# Altium project Flight Controller.PrjPcb (part 1 of 2)
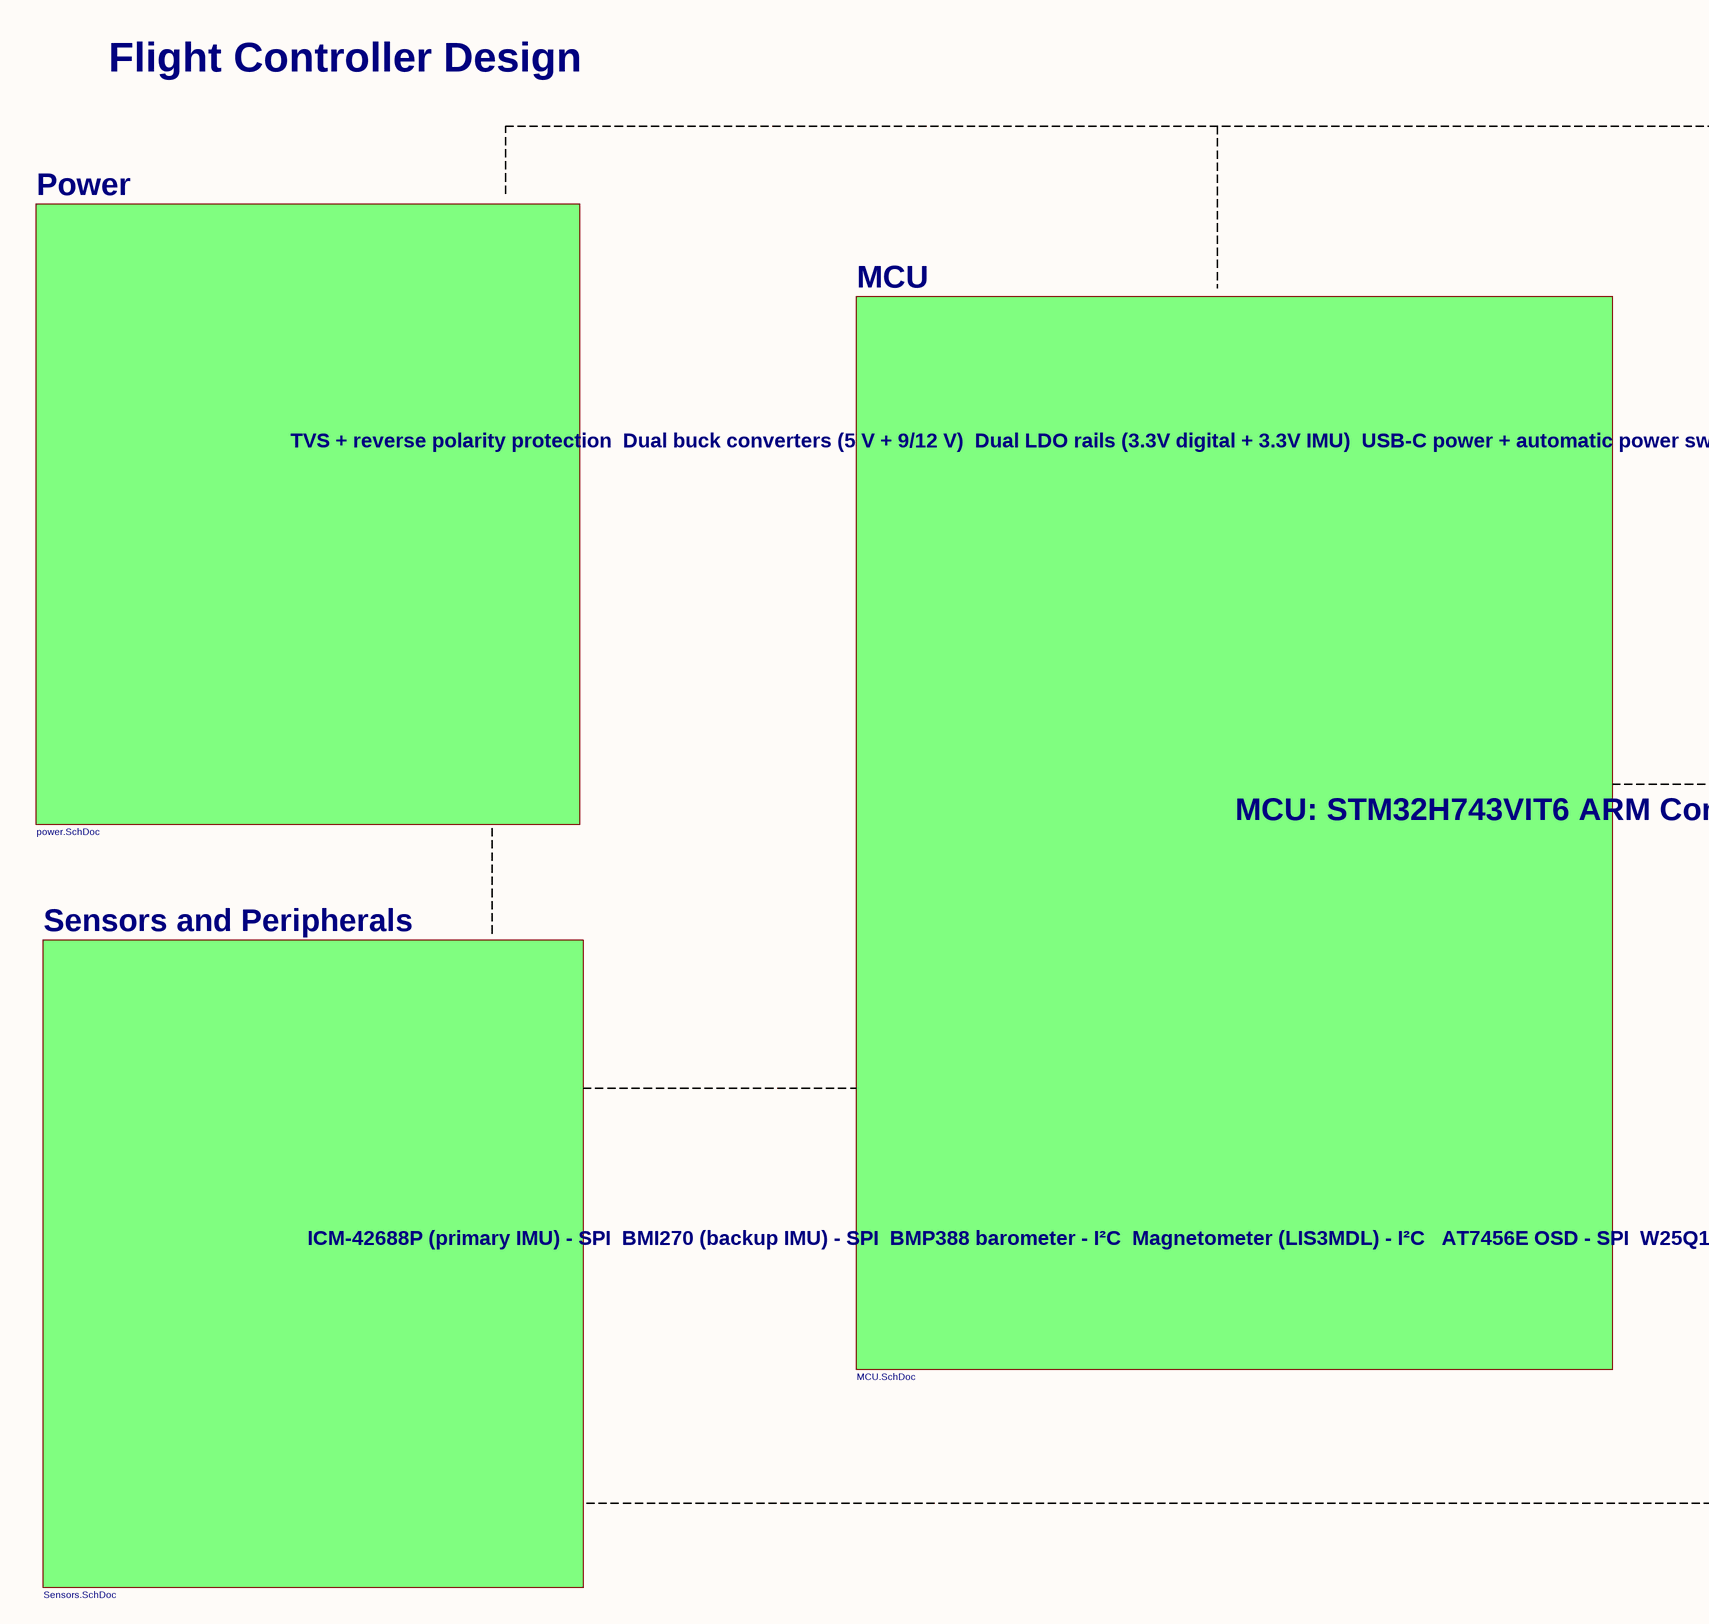
[diagram p0: Flight Controller.SchDoc, left]
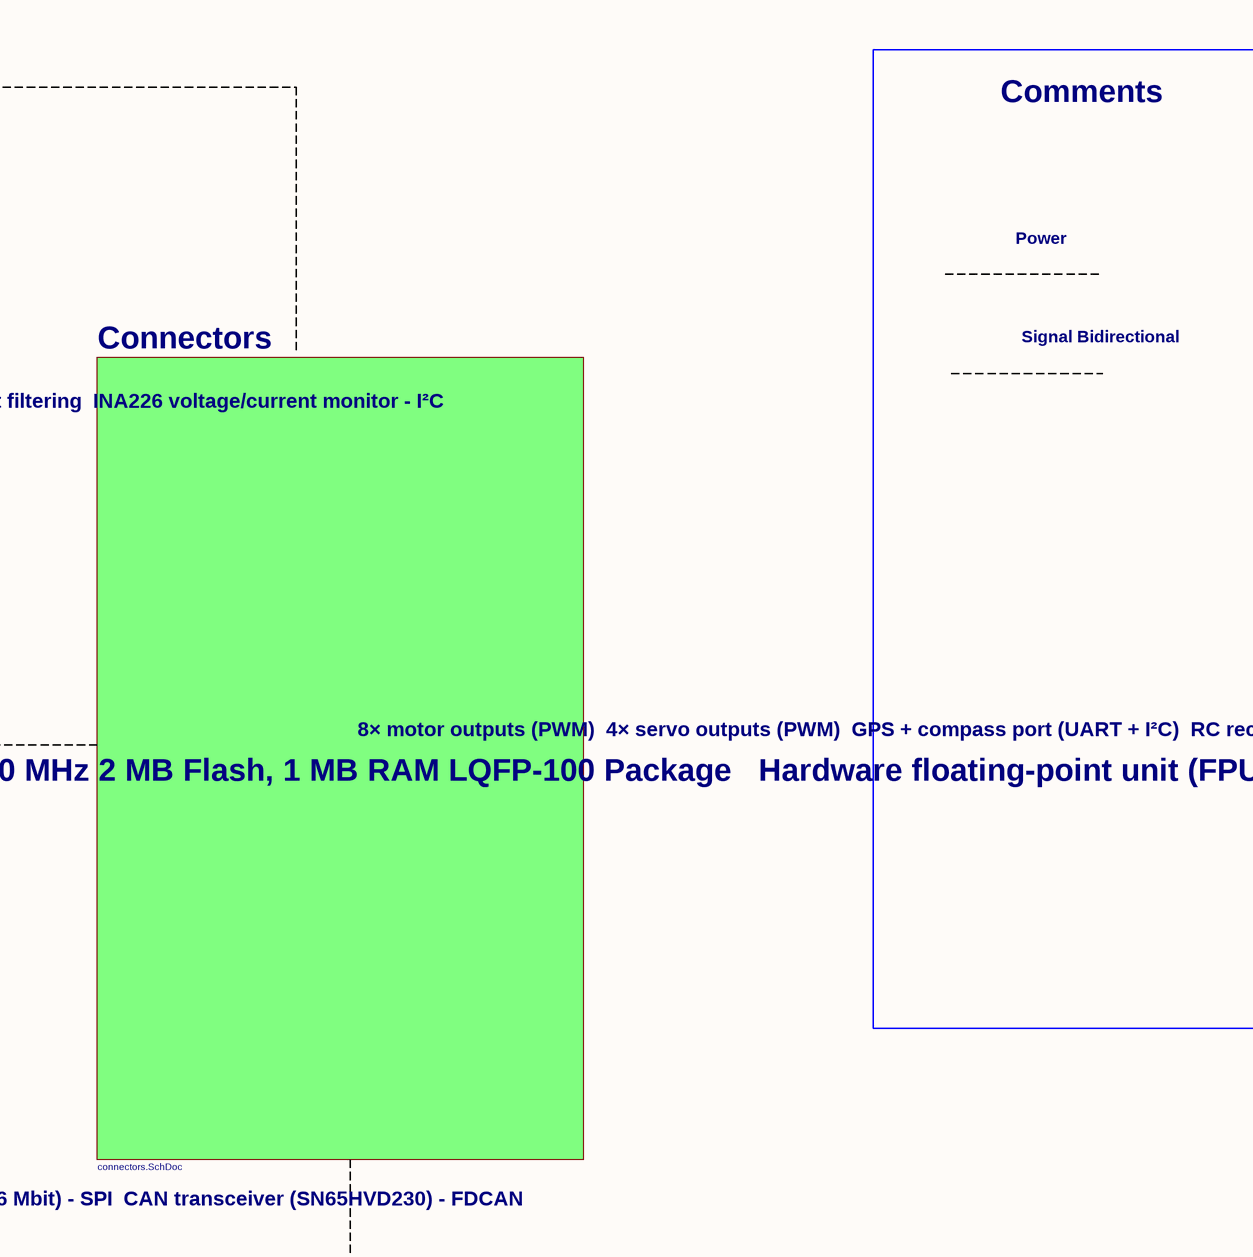
[diagram p1: Flight Controller.SchDoc, right]
5 sheets, 185 parts. Net scope: flat (ports and power ports of the same name join across sheets).
Board file: Flight Controller.PcbDoc
Sheets:
  Flight Controller.SchDoc
    Power = power.SchDoc
    MCU = MCU.SchDoc
    Connectors = connectors.SchDoc
    Sensors and Peripherals = Sensors.SchDoc

## Sheet Flight Controller.SchDoc
size 711 x 342 mm

### Sub-sheets
Connectors = connectors.SchDoc: no entries
MCU = MCU.SchDoc: no entries
Power = power.SchDoc: no entries
Sensors and Peripherals = Sensors.SchDoc: no entries

### Notes on the sheet
- Flight Controller Design
- Comments
- Power
- Signal Bidirectional
- TVS + reverse polarity protection
  Dual buck converters (5 V + 9/12 V)
  Dual LDO rails (3.3V digital + 3.3V IMU)
  USB-C power + automatic power switching
  Basic input filtering
  INA226 voltage/current monitor - I²C
- 8× motor outputs (PWM)
  4× servo outputs (PWM)
  GPS + compass port (UART + I²C)
  RC receiver (SBUS / ELRS UART)
  Telemetry UART
  CAN bus (4-pin)
  Airspeed (I²C)
  VTX (analog + 9/12 V)
  DJI FPV (UART + SBUS)
  USB-C port
- MCU: STM32H743VIT6
  ARM Cortex-M7 @ 480 MHz
  2 MB Flash, 1 MB RAM
  LQFP-100 Package
  Hardware floating-point unit (FPU)
  16-bit/32-bit timers with PWM
  4× SPI, 4× I2C, 8× USART/UART
  2× FDCAN, USB OTG FS/HS
  3× 16-bit ADC (up to 36 channels)
  DMA with DMAMUX
  Built-in UART signal inversion
  Operating voltage: 1.71V - 3.6V
- ICM-42688P (primary IMU) - SPI
  BMI270 (backup IMU) - SPI
  BMP388 barometer - I²C
  Magnetometer (LIS3MDL) - I²C
  AT7456E OSD - SPI
  W25Q128 flash memory (16 Mbit) - SPI
  CAN transceiver (SN65HVD230) - FDCAN
- 1
- 2
- 3
- 4
- 5
- 6
- 7
- 8
- 9
- 10
- 11
- 12
- 13
- 14
- A
- B
- C
- D
- E
- F
- Title:
- File: Flight Controller.kicad_sch
- Sheet: /
- KiCad E.D.A.  kicad (5.1.4)-1
- Size: User
- Date:
- Rev:
- Id: 1/1

## Sheet power.SchDoc
size 584 x 279 mm
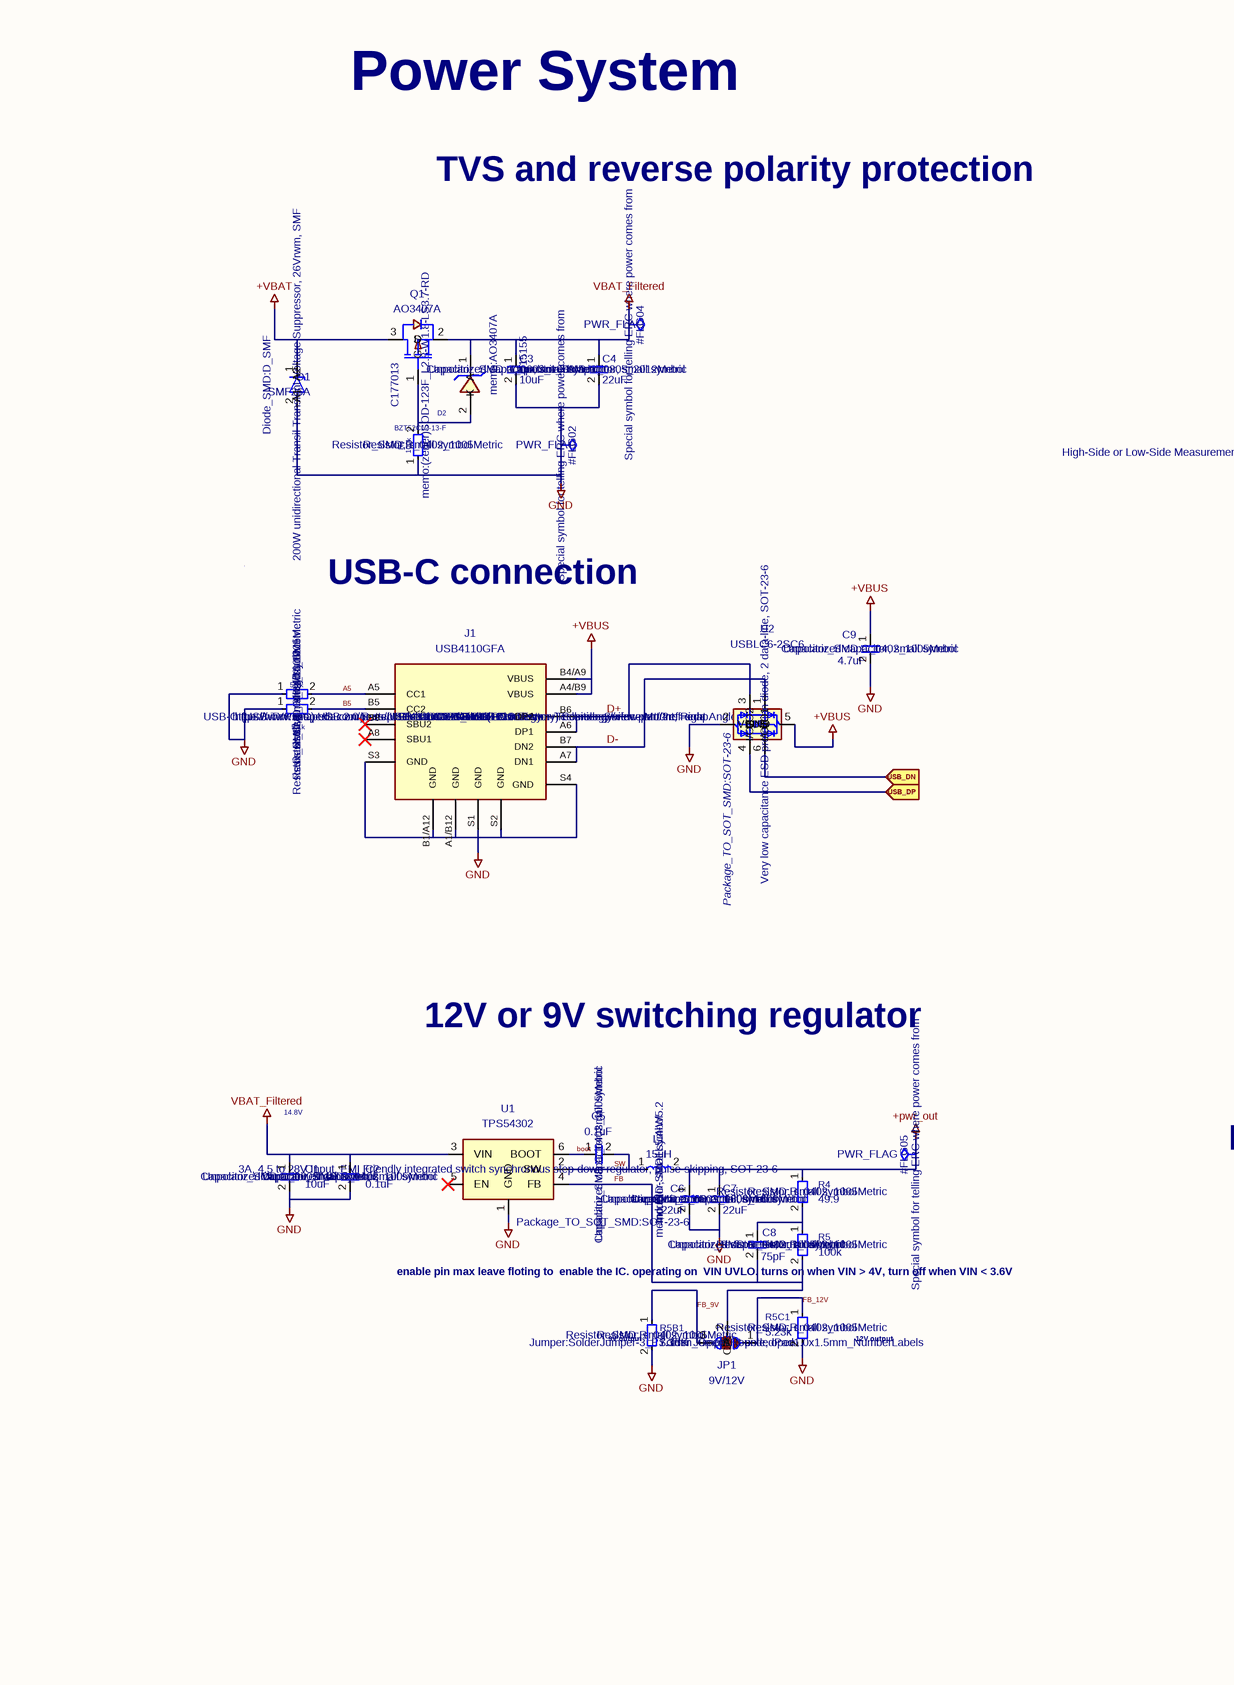
[diagram p2: power.SchDoc, left]
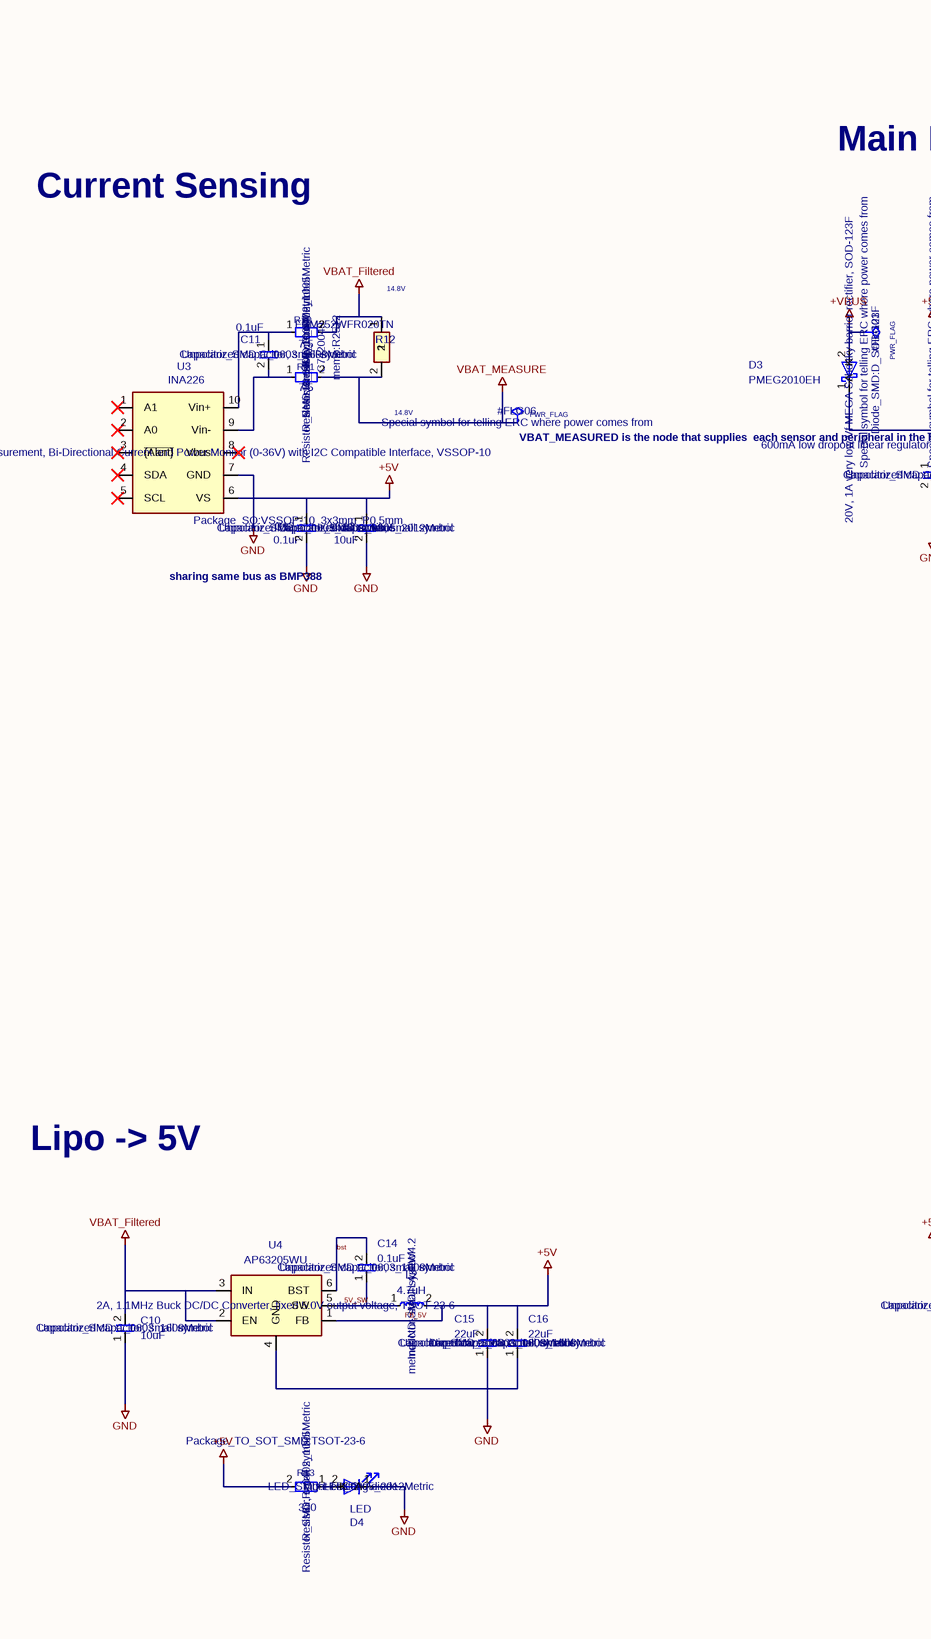
[diagram p3: power.SchDoc, middle]
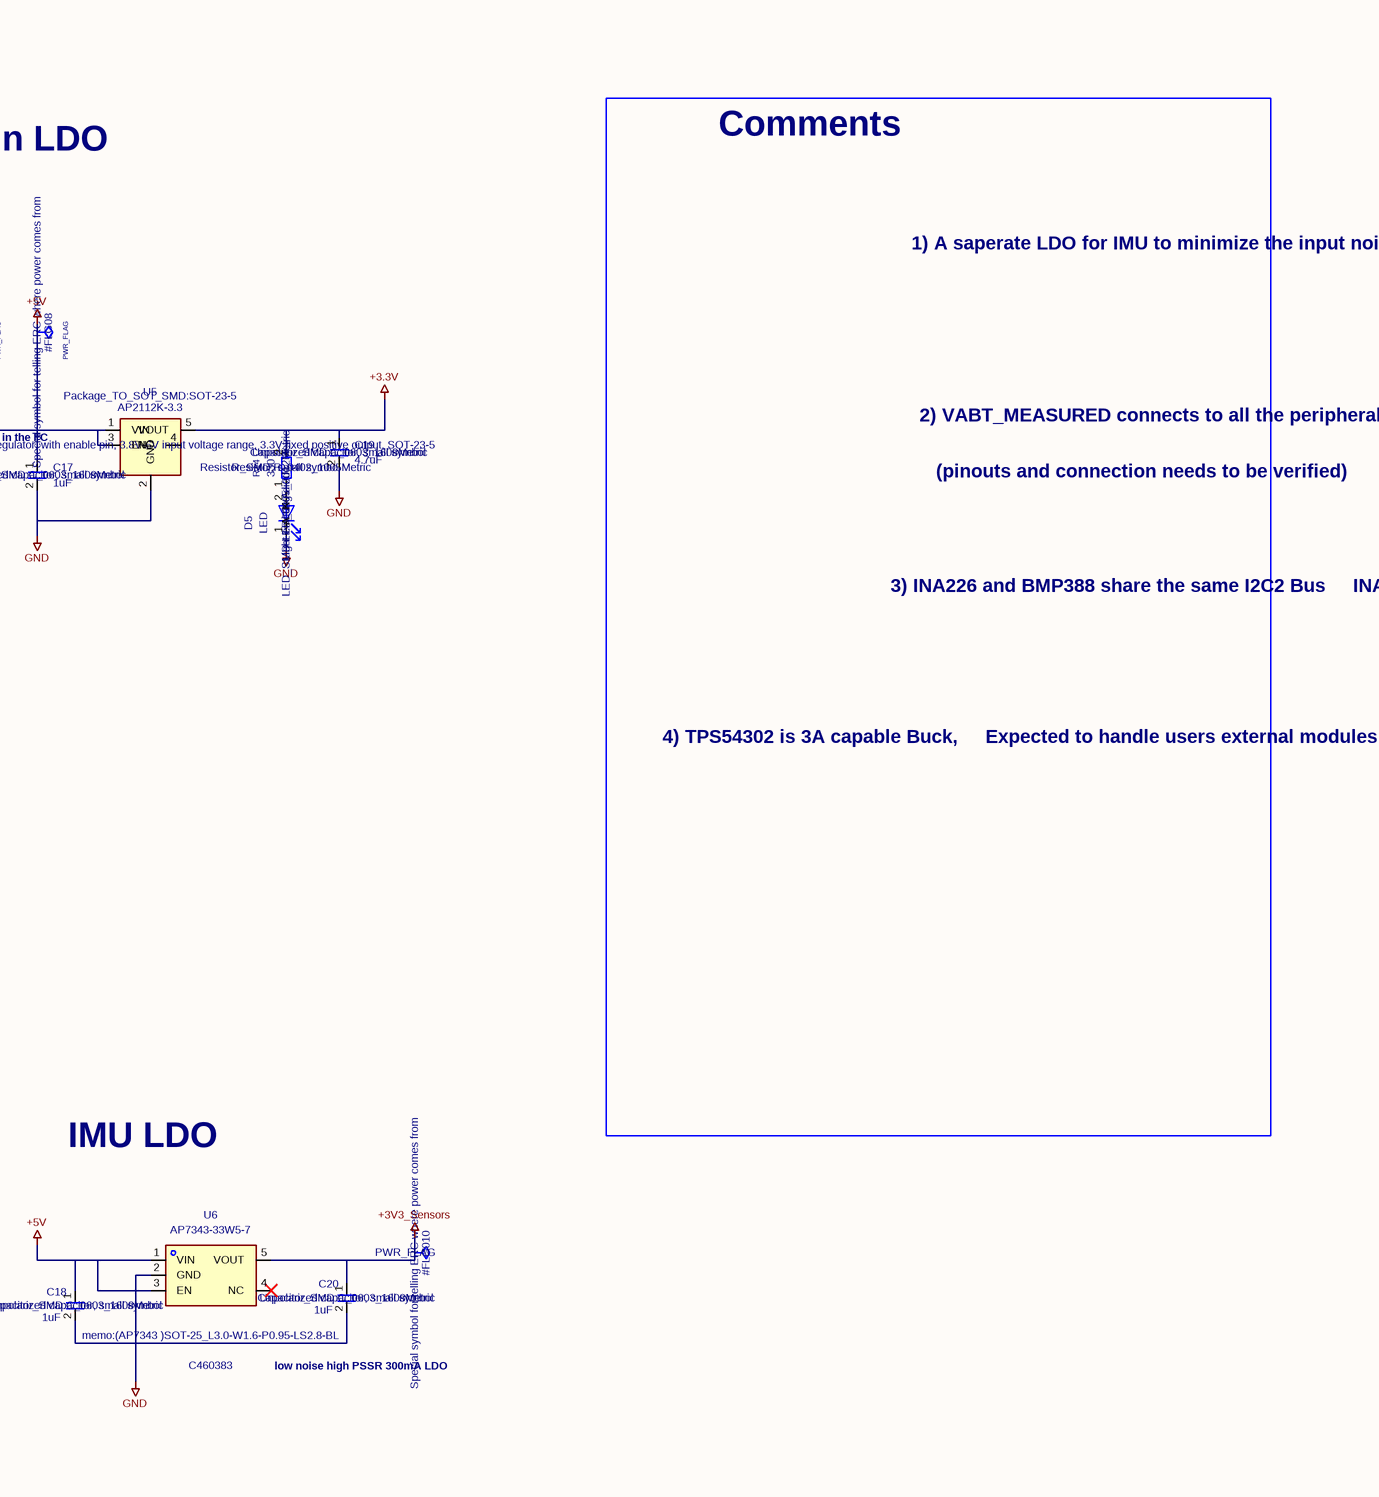
[diagram p4: power.SchDoc, right]

### Parts
#FLG01  Description: Special symbol for telling ERC where power comes from  (hidden comment: PWR_FLAG)  (graphical)
#FLG02  Description: Special symbol for telling ERC where power comes from  (hidden comment: PWR_FLAG)  (graphical)
#FLG04  Description: Special symbol for telling ERC where power comes from  (hidden comment: PWR_FLAG)  (graphical)
#FLG05  Description: Special symbol for telling ERC where power comes from  (hidden comment: PWR_FLAG)  (graphical)
#FLG06  Description: Special symbol for telling ERC where power comes from  (hidden comment: PWR_FLAG)  (graphical)
#FLG08  Description: Special symbol for telling ERC where power comes from  (hidden comment: PWR_FLAG)  (graphical)
#FLG010  Description: Special symbol for telling ERC where power comes from  (hidden comment: PWR_FLAG)  (graphical)
C1  Description: Unpolarized capacitor, small symbol  Footprint: Capacitor_SMD:C_0603_1608Metric  [C_0603_1608Metric]  (hidden comment: 10uF)
C2  Description: Unpolarized capacitor, small symbol  Footprint: Capacitor_SMD:C_0402_1005Metric  [C_0402_1005Metric]  (hidden comment: 0.1uF)
C3  Description: Unpolarized capacitor, small symbol  Footprint: Capacitor_SMD:C_0603_1608Metric  [C_0603_1608Metric]  (hidden comment: 10uF)
C4  Description: Unpolarized capacitor, small symbol  Footprint: Capacitor_SMD:C_0805_2012Metric  [C_0805_2012Metric]  (hidden comment: 22uF)
C5  Description: Unpolarized capacitor, small symbol  Footprint: Capacitor_SMD:C_0402_1005Metric  [C_0402_1005Metric]  (hidden comment: 0.1uF)
C6  Description: Unpolarized capacitor, small symbol  Footprint: Capacitor_SMD:C_0603_1608Metric  [C_0603_1608Metric]  (hidden comment: 22uF)
C7  Description: Unpolarized capacitor, small symbol  Footprint: Capacitor_SMD:C_0603_1608Metric  [C_0603_1608Metric]  (hidden comment: 22uF)
C8  Description: Unpolarized capacitor, small symbol  Footprint: Capacitor_SMD:C_0402_1005Metric  [C_0402_1005Metric]  (hidden comment: 75pF)
C9  Description: Unpolarized capacitor, small symbol  Footprint: Capacitor_SMD:C_0402_1005Metric  [C_0402_1005Metric]  (hidden comment: 4.7uF)
C10  Description: Unpolarized capacitor, small symbol  Footprint: Capacitor_SMD:C_0603_1608Metric  [C_0603_1608Metric]  (hidden comment: 10uF)
C11  Description: Unpolarized capacitor, small symbol  Footprint: Capacitor_SMD:C_0603_1608Metric  [C_0603_1608Metric]  (hidden comment: 0.1uF)
C12  Description: Unpolarized capacitor, small symbol  Footprint: Capacitor_SMD:C_0603_1608Metric  [C_0603_1608Metric]  (hidden comment: 0.1uF)
C13  Description: Unpolarized capacitor, small symbol  Footprint: Capacitor_SMD:C_0805_2012Metric  [C_0805_2012Metric]  (hidden comment: 10uF)
C14  Description: Unpolarized capacitor, small symbol  Footprint: Capacitor_SMD:C_0603_1608Metric  [C_0603_1608Metric]  (hidden comment: 0.1uF)
C15  Description: Unpolarized capacitor, small symbol  Footprint: Capacitor_SMD:C_0603_1608Metric  [C_0603_1608Metric]  (hidden comment: 22uF)
C16  Description: Unpolarized capacitor, small symbol  Footprint: Capacitor_SMD:C_0603_1608Metric  [C_0603_1608Metric]  (hidden comment: 22uF)
C17  Description: Unpolarized capacitor, small symbol  Footprint: Capacitor_SMD:C_0603_1608Metric  [C_0603_1608Metric]  (hidden comment: 1uF)
C18  Description: Unpolarized capacitor, small symbol  Footprint: Capacitor_SMD:C_0603_1608Metric  [C_0603_1608Metric]  (hidden comment: 1uF)
C19  Description: Unpolarized capacitor, small symbol  Footprint: Capacitor_SMD:C_0603_1608Metric  [C_0603_1608Metric]  (hidden comment: 4.7uF)
C20  Description: Unpolarized capacitor, small symbol  Footprint: Capacitor_SMD:C_0603_1608Metric  [C_0603_1608Metric]  (hidden comment: 1uF)
D1  Description: 200W unidirectional Transil Transient Voltage Suppressor, 26Vrwm, SMF  Footprint: Diode_SMD:D_SMF  [D_SMF]  (hidden comment: SMF26A)
D2  LCSC Part: C177013  Footprint: memo:(zener)SOD-123F_L2.8-W1.8-LS3.7-RD  [(zener)SOD-123F_L2.8-W1.8-LS3.7-RD]  (hidden comment: BZT52C12-13-F)
D3  Description: 20V, 1A very low Vf MEGA Schottky barrier rectifier, SOD-123F  Footprint: Diode_SMD:D_SOD-123F  [D_SOD-123F]  (hidden comment: PMEG2010EH)
D4  Description: Light emitting diode  Sim.Pins: 1=K 2=A  Footprint: LED_SMD:LED_0805_2012Metric  [LED_0805_2012Metric]  (hidden comment: LED)
D5  Description: Light emitting diode  Sim.Pins: 1=K 2=A  Footprint: LED_SMD:LED_0805_2012Metric  [LED_0805_2012Metric]  (hidden comment: LED)
J1  MF: Global Connector Technology  Description_1: USB-C (USB TYPE-C) USB 2.0 Receptacle Connector 24 (16+8 Dummy) Position Surface Mount, Right Angle  Package: None  Availability: In Stock  Footprint: memo:GCT_USB4110GFA  [GCT_USB4110GFA]  (hidden comment: USB4110GFA)
JP1  Description: Solder Jumper, 3-pole, open  Footprint: Jumper:SolderJumper-3_P1.3mm_Open_RoundedPad1.0x1.5mm_NumberLabels  [SolderJumper-3_P1.3mm_Open_RoundedPad1.0x1.5mm_NumberLabels]  (hidden comment: 9V/12V)
L1  Description: Inductor, small symbol  Footprint: memo:IND-SMD_L5.4-W5.2  [IND-SMD_L5.4-W5.2]  (hidden comment: 15uH)
L2  Description: Inductor, small symbol  Footprint: memo:IND-SMD_L4.4-W4.2  [IND-SMD_L4.4-W4.2]  (hidden comment: 4.7uH)
Q1  LCSC Part: C15155  Footprint: memo:AO3407A  [AO3407A]  (hidden comment: AO3407A)
R1  Description: Resistor, small symbol  Footprint: Resistor_SMD:R_0402_1005Metric  [R_0402_1005Metric]  (hidden comment: 5.1k)
R2  Description: Resistor, small symbol  Footprint: Resistor_SMD:R_0402_1005Metric  [R_0402_1005Metric]  (hidden comment: 5.1k)
R3  Description: Resistor, small symbol  Footprint: Resistor_SMD:R_0402_1005Metric  [R_0402_1005Metric]  (hidden comment: 100k)
R4  Description: Resistor, small symbol  Footprint: Resistor_SMD:R_0402_1005Metric  [R_0402_1005Metric]  (hidden comment: 49.9)
R5  Description: Resistor, small symbol  Footprint: Resistor_SMD:R_0402_1005Metric  [R_0402_1005Metric]  (hidden comment: 100k)
R5B1  Description: Resistor, small symbol  Footprint: Resistor_SMD:R_0402_1005Metric  [R_0402_1005Metric]  (hidden comment: 7.15K)
R5C1  Description: Resistor, small symbol  Footprint: Resistor_SMD:R_0402_1005Metric  [R_0402_1005Metric]  (hidden comment: 5.23k)
R10  Description: Resistor, small symbol  Footprint: Resistor_SMD:R_0402_1005Metric  [R_0402_1005Metric]  (hidden comment: 7.5)
R11  Description: Resistor, small symbol  Footprint: Resistor_SMD:R_0402_1005Metric  [R_0402_1005Metric]  (hidden comment: 7.5)
R12  LCSC Part: C7420049  Footprint: memo:R2512  [R2512]  (hidden comment: FRM252WFR020TN)
R13  Description: Resistor, small symbol  Footprint: Resistor_SMD:R_0402_1005Metric  [R_0402_1005Metric]  (hidden comment: 330)
R14  Description: Resistor, small symbol  Footprint: Resistor_SMD:R_0402_1005Metric  [R_0402_1005Metric]  (hidden comment: 330)
U1  Description: 3A, 4.5 to 28V Input, EMI Friendly integrated switch synchronous step-down regulator, pulse-skipping, SOT-23-6  Footprint: Package_TO_SOT_SMD:SOT-23-6  [SOT-23-6]  (hidden comment: TPS54302)
U2  Description: Very low capacitance ESD protection diode, 2 data-line, SOT-23-6  Footprint: Package_TO_SOT_SMD:SOT-23-6  [SOT-23-6]  (hidden comment: USBLC6-2SC6)
U3  Description: High-Side or Low-Side Measurement, Bi-Directional Current and Power Monitor (0-36V) with I2C Compatible Interface, VSSOP-10  Footprint: Package_SO:VSSOP-10_3x3mm_P0.5mm  [VSSOP-10_3x3mm_P0.5mm]  (hidden comment: INA226)
U4  Description: 2A, 1.1MHz Buck DC/DC Converter, fixed 5.0V output voltage, TSOT-23-6  Footprint: Package_TO_SOT_SMD:TSOT-23-6  [TSOT-23-6]  (hidden comment: AP63205WU)
U5  Description: 600mA low dropout linear regulator, with enable pin, 3.8V-6V input voltage range, 3.3V fixed positive output, SOT-23-5  Footprint: Package_TO_SOT_SMD:SOT-23-5  [SOT-23-5]  (hidden comment: AP2112K-3.3)
U6  LCSC Part: C460383  Footprint: memo:(AP7343 )SOT-25_L3.0-W1.6-P0.95-LS2.8-BL  [(AP7343 )SOT-25_L3.0-W1.6-P0.95-LS2.8-BL]  (hidden comment: AP7343-33W5-7)

### Ports
USB_DN (in), USB_DP (in)

### Nets
+3.3V: C19.1 R14.2 U5.5(VOUT)
+3V3_Sensors: #FLG010.1 C20.1 U6.5(VOUT)
+pwr_out: #FLG05.1 C6.1 C7.1 L1.2 R4.1
+VBAT: D1.1(A1) Q1.3(D)
+VBUS: #FLG01.1 C9.1 D3.2(A) J1.A4/B9(VBUS) J1.B4/A9(VBUS) U2.5(VBUS)
FB_5V: #FLG08.1 C12.1 C13.1 C15.2 C16.2 C17.1 C18.1 D3.1(K) L2.2 R13.2 U3.6(VS) U4.1(FB) U5.1(VIN) U5.3(EN) U6.1(VIN) U6.3(EN)  [also labelled +5V]
GND: #FLG02.1 C1.2 C2.2 C3.2 C4.2 C6.2 C7.2 C9.2 C10.1 C12.2 C13.2 C15.1 C16.1 C17.2 C18.2 C19.2 C20.2 D1.2(A2) D4.1(K) D5.1(K) J1.A1/B12(GND) J1.B1/A12(GND) J1.S1(GND) J1.S2(GND) J1.S3(GND) J1.S4(GND) R1.1 R2.1 R3.1 R5B1.2 R5C1.2 U1.1(GND) U2.2(GND) U3.7(GND) U4.4(GND) U5.2(GND) U6.2(GND)
VBAT_Filtered: #FLG04.1 C1.1 C2.1 C3.1 C4.1 C10.2 D2.1(K) Q1.2(S) R10.2 R12.1 U1.3(VIN) U4.2(EN) U4.3(IN)
VBAT_MEASURE: #FLG06.1 R11.2 R12.2
5V_SW: C14.1 L2.1 U4.5(SW)
A5: J1.A5(CC1) R1.2
B5: J1.B5(CC2) R2.2
boot: C5.1 U1.6(BOOT)
bst: C14.2 U4.6(BST)
D+: J1.A6(DP1) J1.B6(DP2) U2.3(I/O2)
D-: J1.A7(DN1) J1.B7(DN2) U2.1(I/O1)
FB: C8.2 JP1.2(C) R5.2 U1.4(FB)
FB_9V: JP1.3(B) R5B1.1
FB_12V: JP1.1(A) R5C1.1
SW: C5.2 L1.1 U1.2(SW)
USB_DN: U2.6(I/O1) ; port USB_DN
USB_DP: U2.4(I/O2) ; port USB_DP
NetC8_1: C8.1 R4.2 R5.1
NetC11_1: C11.1 R10.1 U3.10(Vin+)
NetC11_2: C11.2 R11.1 U3.9(Vin-)
NetD2_2: D2.2(A) Q1.1(G) R3.2
NetD4_2: D4.2(A) R13.1
NetD5_2: D5.2(A) R14.1

Not connected (* = marked no-connect by the designer): J1 A8(SBU1)* B8(SBU2)*; U1 5(EN)*; U3 1(A1)* 2(A0)* 3(~{{Alert}})* 4(SDA)* 5(SCL)* 8(Vbus)*; U5 4(NC); U6 4(NC)*

### Notes on the sheet
- Power System
- Main LDO
- Comments
- TVS and reverse polarity protection
- Current Sensing
- (near R12) 14.8V
- 1) A saperate LDO for IMU to minimize the input noise
  per multiple firmwares advise.
- (near #FLG06) VBAT_MEASURED is the node that supplies
  each sensor and peripheral in the FC
- 2) VABT_MEASURED connects to all the peripherals on the
  FC and is able to measure Current and Voltage over I2C
  eliminating the need for ADC pins on mcu.
- (pinouts and connection needs to be verified)
- USB-C connection
- (near C12) sharing same bus as BMP388
- 3) INA226 and BMP388 share the same I2C2 Bus
  INA226 Address : 0X40 A0, A1 -> GND
  BMP388 Address : 0X76  SDO -> GND
- 4) TPS54302 is 3A capable Buck,
  Expected to handle users external modules
  attachements. DJI Air Unit, Analog VTX, etc...
- 12V or 9V switching regulator
- 14.8V
- Lipo -> 5V
- IMU LDO
- enable pin max leave floting to
  enable the IC. operating on
  VIN UVLO. turns on when VIN
  > 4V, turn off when VIN < 3.6V
- (near R5B1) 9V output
- (near R5C1) 12V output
- low noise high PSSR 300mA LDO
- 1
- 2
- 3
- 4
- 5
- 6
- 7
- 8
- 9
- 10
- 11
- A
- B
- C
- D
- E
- Title:
- File: power.kicad_sch
- Sheet: /
- KiCad E.D.A.  kicad (5.1.4)-1
- Size: User
- Date:
- Rev:
- Id: 1/1

### Library data of the parts
C1-C20 = C_Small
  C1 C3 C10 C13: Value: 10uF
  C2 C5 C11 C12 C14: Value: 0.1uF
  C4 C6 C7 C15 C16: Value: 22uF
  C8: Value: 75pF
  C9 C19: Value: 4.7uF
  C17 C18 C20: Value: 1uF
JP1 = SolderJumper_3_Open: Value: 9V/12V
L1 L2 = L_Small
  L1: Value: 15uH
  L2: Value: 4.7uH
R1-R5 R5B1 R5C1 R10 R11 R13 R14 = R_Small
  R1 R2: Value: 5.1k
  R3 R5: Value: 100k
  R4: Value: 49.9
  R5B1: Value: 7.15K
  R5C1: Value: 5.23k
  R10 R11: Value: 7.5
  R13 R14: Value: 330
#FLG01 #FLG02 #FLG04 #FLG05 #FLG06 #FLG08 #FLG010 = PWR_FLAG: Value: PWR_FLAG
D1 = SMF26A: Value: SMF26A
D2 = BZT52C12-13-F: Value: BZT52C12-13-F
D3 = PMEG2010EH: Value: PMEG2010EH
D4 D5 = LED: Value: LED
J1 = USB4110GFA: Price: None; SnapEDA_Link: https://www.snapeda.com/parts/USB4110GFA/Global+Connector+Technology/view-part/?ref=snap; MP: USB4110GFA; Check_prices: https://www.snapeda.com/parts/USB4110GFA/Global+Connector+Technology/view-part/?ref=eda; Value: USB4110GFA
Q1 = AO3407A: Value: AO3407A
R12 = FRM252WFR020TN: Value: FRM252WFR020TN
U1 = TPS54302: Value: TPS54302
U2 = USBLC6-2SC6: Value: USBLC6-2SC6
U3 = INA226: Value: INA226
U4 = AP63205WU: Value: AP63205WU
U5 = AP2112K-3.3: Value: AP2112K-3.3
U6 = AP7343-33W5-7: Value: AP7343-33W5-7

## Sheet MCU.SchDoc
size 457 x 279 mm
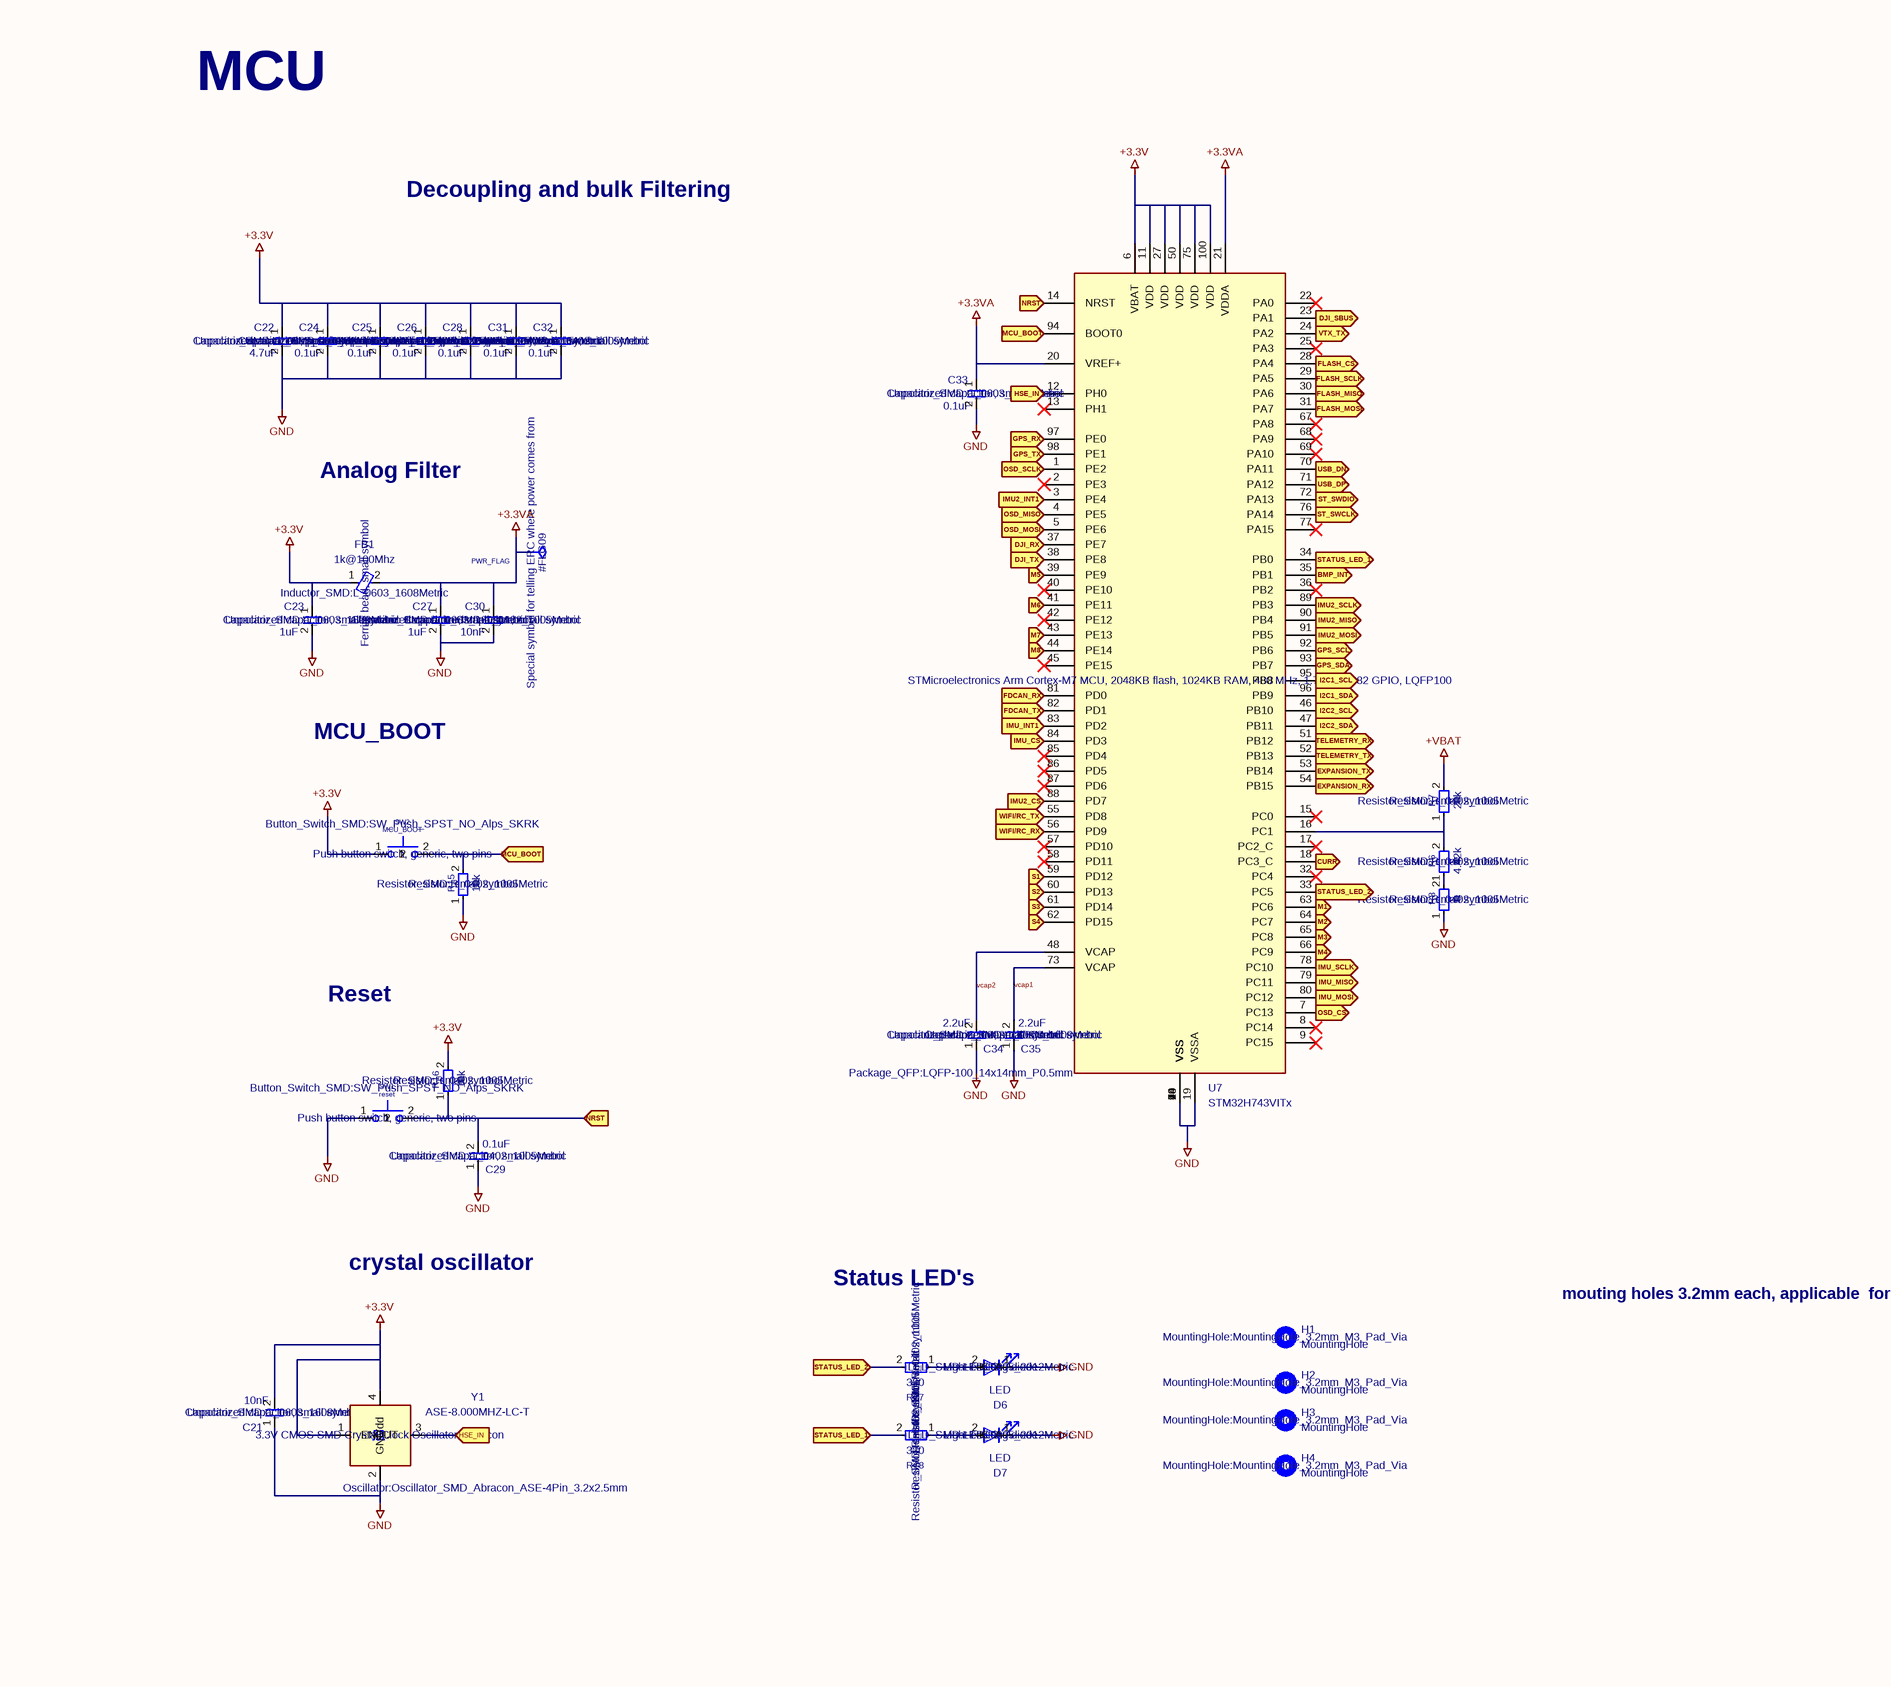
[diagram p5: MCU.SchDoc, left]
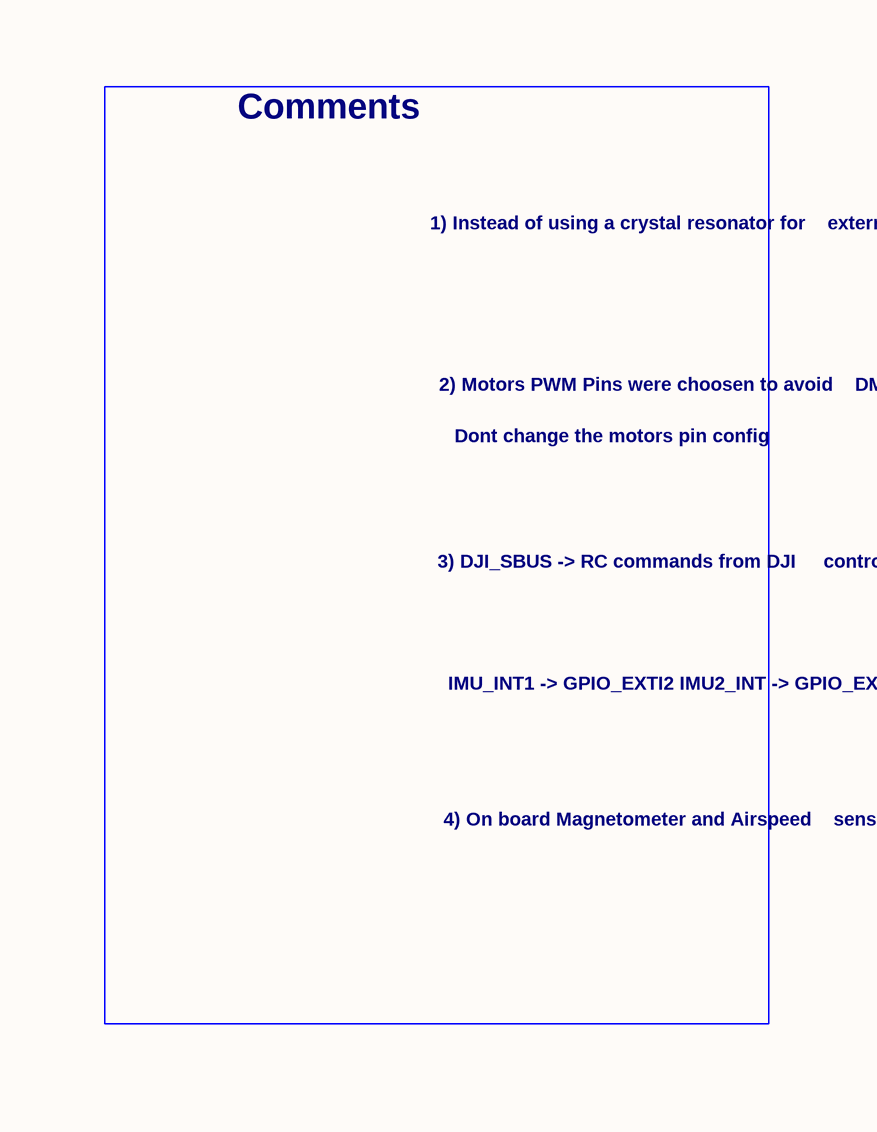
[diagram p6: MCU.SchDoc, right]

### Parts
#FLG09  Description: Special symbol for telling ERC where power comes from  (hidden comment: PWR_FLAG)  (graphical)
C21  Description: Unpolarized capacitor, small symbol  Footprint: Capacitor_SMD:C_0603_1608Metric  [C_0603_1608Metric]  (hidden comment: 10nF)
C22  Description: Unpolarized capacitor, small symbol  Footprint: Capacitor_SMD:C_0603_1608Metric  [C_0603_1608Metric]  (hidden comment: 4.7uF)
C23  Description: Unpolarized capacitor, small symbol  Footprint: Capacitor_SMD:C_0603_1608Metric  [C_0603_1608Metric]  (hidden comment: 1uF)
C24  Description: Unpolarized capacitor, small symbol  Footprint: Capacitor_SMD:C_0402_1005Metric  [C_0402_1005Metric]  (hidden comment: 0.1uF)
C25  Description: Unpolarized capacitor, small symbol  Footprint: Capacitor_SMD:C_0402_1005Metric  [C_0402_1005Metric]  (hidden comment: 0.1uF)
C26  Description: Unpolarized capacitor, small symbol  Footprint: Capacitor_SMD:C_0402_1005Metric  [C_0402_1005Metric]  (hidden comment: 0.1uF)
C27  Description: Unpolarized capacitor, small symbol  Footprint: Capacitor_SMD:C_0603_1608Metric  [C_0603_1608Metric]  (hidden comment: 1uF)
C28  Description: Unpolarized capacitor, small symbol  Footprint: Capacitor_SMD:C_0402_1005Metric  [C_0402_1005Metric]  (hidden comment: 0.1uF)
C29  Description: Unpolarized capacitor, small symbol  Footprint: Capacitor_SMD:C_0402_1005Metric  [C_0402_1005Metric]  (hidden comment: 0.1uF)
C30  Description: Unpolarized capacitor, small symbol  Footprint: Capacitor_SMD:C_0402_1005Metric  [C_0402_1005Metric]  (hidden comment: 10nF)
C31  Description: Unpolarized capacitor, small symbol  Footprint: Capacitor_SMD:C_0402_1005Metric  [C_0402_1005Metric]  (hidden comment: 0.1uF)
C32  Description: Unpolarized capacitor, small symbol  Footprint: Capacitor_SMD:C_0402_1005Metric  [C_0402_1005Metric]  (hidden comment: 0.1uF)
C33  Description: Unpolarized capacitor, small symbol  Footprint: Capacitor_SMD:C_0603_1608Metric  [C_0603_1608Metric]  (hidden comment: 0.1uF)
C34  Description: Unpolarized capacitor, small symbol  Footprint: Capacitor_SMD:C_0603_1608Metric  [C_0603_1608Metric]  (hidden comment: 2.2uF)
C35  Description: Unpolarized capacitor, small symbol  Footprint: Capacitor_SMD:C_0603_1608Metric  [C_0603_1608Metric]  (hidden comment: 2.2uF)
D6  Description: Light emitting diode  Sim.Pins: 1=K 2=A  Footprint: LED_SMD:LED_0805_2012Metric  [LED_0805_2012Metric]  (hidden comment: LED)
D7  Description: Light emitting diode  Sim.Pins: 1=K 2=A  Footprint: LED_SMD:LED_0805_2012Metric  [LED_0805_2012Metric]  (hidden comment: LED)
FB1  Description: Ferrite bead, small symbol  Footprint: Inductor_SMD:L_0603_1608Metric  [L_0603_1608Metric]  (hidden comment: 1k@100Mhz)
H1  Footprint: MountingHole:MountingHole_3.2mm_M3_Pad_Via  [MountingHole_3.2mm_M3_Pad_Via]  (hidden comment: MountingHole)
H2  Footprint: MountingHole:MountingHole_3.2mm_M3_Pad_Via  [MountingHole_3.2mm_M3_Pad_Via]  (hidden comment: MountingHole)
H3  Footprint: MountingHole:MountingHole_3.2mm_M3_Pad_Via  [MountingHole_3.2mm_M3_Pad_Via]  (hidden comment: MountingHole)
H4  Footprint: MountingHole:MountingHole_3.2mm_M3_Pad_Via  [MountingHole_3.2mm_M3_Pad_Via]  (hidden comment: MountingHole)
R6  Description: Resistor, small symbol  Footprint: Resistor_SMD:R_0402_1005Metric  [R_0402_1005Metric]  (hidden comment: 4.42k)
R7  Description: Resistor, small symbol  Footprint: Resistor_SMD:R_0402_1005Metric  [R_0402_1005Metric]  (hidden comment: 20k)
R8  Description: Resistor, small symbol  Footprint: Resistor_SMD:R_0402_1005Metric  [R_0402_1005Metric]  (hidden comment: 0)
R15  Description: Resistor, small symbol  Footprint: Resistor_SMD:R_0402_1005Metric  [R_0402_1005Metric]  (hidden comment: 10k)
R16  Description: Resistor, small symbol  Footprint: Resistor_SMD:R_0402_1005Metric  [R_0402_1005Metric]  (hidden comment: 10k)
R17  Description: Resistor, small symbol  Footprint: Resistor_SMD:R_0402_1005Metric  [R_0402_1005Metric]  (hidden comment: 330)
R18  Description: Resistor, small symbol  Footprint: Resistor_SMD:R_0402_1005Metric  [R_0402_1005Metric]  (hidden comment: 330)
SW1  Description: Push button switch, generic, two pins  Footprint: Button_Switch_SMD:SW_Push_SPST_NO_Alps_SKRK  [SW_Push_SPST_NO_Alps_SKRK]  (hidden comment: reset)
SW2  Description: Push button switch, generic, two pins  Footprint: Button_Switch_SMD:SW_Push_SPST_NO_Alps_SKRK  [SW_Push_SPST_NO_Alps_SKRK]  (hidden comment: MCU_BOOT)
U7  Description: STMicroelectronics Arm Cortex-M7 MCU, 2048KB flash, 1024KB RAM, 480 MHz, 1.71-3.6V, 82 GPIO, LQFP100  Footprint: Package_QFP:LQFP-100_14x14mm_P0.5mm  [LQFP-100_14x14mm_P0.5mm]  (hidden comment: STM32H743VITx)
Y1  Description: 3.3V CMOS SMD Crystal Clock Oscillator, Abracon  Footprint: Oscillator:Oscillator_SMD_Abracon_ASE-4Pin_3.2x2.5mm  [Oscillator_SMD_Abracon_ASE-4Pin_3.2x2.5mm]  (hidden comment: ASE-8.000MHZ-LC-T)

### Ports
BMP_INT (in), CURR (in), DJI_RX (in), DJI_SBUS (in), DJI_TX (in), EXPANSION_RX (in), EXPANSION_TX (in), FDCAN_RX (in), FDCAN_TX (in), FLASH_CS (in), FLASH_MISO (in), FLASH_MOSI (in), FLASH_SCLK (in), GPS_RX (in), GPS_SCL (in), GPS_SDA (in), GPS_TX (in), HSE_IN (in), I2C1_SCL (in), I2C1_SDA (in), I2C2_SCL (in), I2C2_SDA (in), IMU2_CS (in), IMU2_INT1 (in), IMU2_MISO (in), IMU2_MOSI (in), IMU2_SCLK (in), IMU_CS (in), IMU_INT1 (in), IMU_MISO (in), IMU_MOSI (in), IMU_SCLK (in), M1 (in), M2 (in), M3 (in), M4 (in), M5 (in), M6 (in), M7 (in), M8 (in), MCU_BOOT (in), NRST (in), OSD_CS (in), OSD_MISO (in), OSD_MOSI (in), OSD_SCLK (in), S1 (in), S2 (in), S3 (in), S4 (in), ST_SWCLK (in), ST_SWDIO (in), STATUS_LED_1 (in), STATUS_LED_2 (in), TELEMETRY_RX (in), TELEMETRY_TX (in), USB_DN (in), USB_DP (in), VTX_TX (in), WIFI/RC_RX (in), WIFI/RC_TX (in)

### Nets
+3.3V: C21.2 C22.1 C23.1 C24.1 C25.1 C26.1 C28.1 C31.1 C32.1 FB1.1 R16.2 SW2.1 U7.6(VBAT) U7.11(VDD) U7.27(VDD) U7.50(VDD) U7.75(VDD) U7.100(VDD) Y1.1(EN) Y1.4(Vdd)
+3.3VA: #FLG09.1 C27.1 C30.1 C33.1 FB1.2 U7.20(VREF+) U7.21(VDDA)
+VBAT: R7.2
GND: C21.1 C22.2 C23.2 C24.2 C25.2 C26.2 C27.2 C28.2 C29.1 C30.2 C31.2 C32.2 C33.2 C34.1 C35.1 D6.1(K) D7.1(K) R8.1 R15.1 SW1.1 U7.10(VSS) U7.19(VSSA) U7.26(VSS) U7.49(VSS) U7.74(VSS) U7.99(VSS) Y1.2(GND)
BMP_INT: U7.35(PB1) ; port BMP_INT
CURR: U7.18(PC3_C) ; port CURR
DJI_RX: U7.37(PE7) ; port DJI_RX
DJI_SBUS: U7.23(PA1) ; port DJI_SBUS
DJI_TX: U7.38(PE8) ; port DJI_TX
EXPANSION_RX: U7.54(PB15) ; port EXPANSION_RX
EXPANSION_TX: U7.53(PB14) ; port EXPANSION_TX
FDCAN_RX: U7.81(PD0) ; port FDCAN_RX
FDCAN_TX: U7.82(PD1) ; port FDCAN_TX
FLASH_CS: U7.28(PA4) ; port FLASH_CS
FLASH_MISO: U7.30(PA6) ; port FLASH_MISO
FLASH_MOSI: U7.31(PA7) ; port FLASH_MOSI
FLASH_SCLK: U7.29(PA5) ; port FLASH_SCLK
GPS_RX: U7.97(PE0) ; port GPS_RX
GPS_SCL: U7.92(PB6) ; port GPS_SCL
GPS_SDA: U7.93(PB7) ; port GPS_SDA
GPS_TX: U7.98(PE1) ; port GPS_TX
HSE_IN: U7.12(PH0) Y1.3(OUT) ; port HSE_IN
I2C1_SCL: U7.95(PB8) ; port I2C1_SCL
I2C1_SDA: U7.96(PB9) ; port I2C1_SDA
I2C2_SCL: U7.46(PB10) ; port I2C2_SCL
I2C2_SDA: U7.47(PB11) ; port I2C2_SDA
IMU2_CS: U7.88(PD7) ; port IMU2_CS
IMU2_INT1: U7.3(PE4) ; port IMU2_INT1
IMU2_MISO: U7.90(PB4) ; port IMU2_MISO
IMU2_MOSI: U7.91(PB5) ; port IMU2_MOSI
IMU2_SCLK: U7.89(PB3) ; port IMU2_SCLK
IMU_CS: U7.84(PD3) ; port IMU_CS
IMU_INT1: U7.83(PD2) ; port IMU_INT1
IMU_MISO: U7.79(PC11) ; port IMU_MISO
IMU_MOSI: U7.80(PC12) ; port IMU_MOSI
IMU_SCLK: U7.78(PC10) ; port IMU_SCLK
M1: U7.63(PC6) ; port M1
M2: U7.64(PC7) ; port M2
M3: U7.65(PC8) ; port M3
M4: U7.66(PC9) ; port M4
M5: U7.39(PE9) ; port M5
M6: U7.41(PE11) ; port M6
M7: U7.43(PE13) ; port M7
M8: U7.44(PE14) ; port M8
MCU_BOOT: R15.2 SW2.2 U7.94(BOOT0) ; port MCU_BOOT
NRST: C29.2 R16.1 SW1.2 U7.14(NRST) ; port NRST
OSD_CS: U7.7(PC13) ; port OSD_CS
OSD_MISO: U7.4(PE5) ; port OSD_MISO
OSD_MOSI: U7.5(PE6) ; port OSD_MOSI
OSD_SCLK: U7.1(PE2) ; port OSD_SCLK
S1: U7.59(PD12) ; port S1
S2: U7.60(PD13) ; port S2
S3: U7.61(PD14) ; port S3
S4: U7.62(PD15) ; port S4
ST_SWCLK: U7.76(PA14) ; port ST_SWCLK
ST_SWDIO: U7.72(PA13) ; port ST_SWDIO
STATUS_LED_1: R18.2 U7.34(PB0) ; port STATUS_LED_1
STATUS_LED_2: R17.2 U7.33(PC5) ; port STATUS_LED_2
TELEMETRY_RX: U7.51(PB12) ; port TELEMETRY_RX
TELEMETRY_TX: U7.52(PB13) ; port TELEMETRY_TX
USB_DN: U7.70(PA11) ; port USB_DN
USB_DP: U7.71(PA12) ; port USB_DP
vcap1: C35.2 U7.73(VCAP)
vcap2: C34.2 U7.48(VCAP)
VTX_TX: U7.24(PA2) ; port VTX_TX
WIFI/RC_RX: U7.56(PD9) ; port WIFI/RC_RX
WIFI/RC_TX: U7.55(PD8) ; port WIFI/RC_TX
NetD6_2: D6.2(A) R17.1
NetD7_2: D7.2(A) R18.1
NetR6_1: R6.1 R8.2
NetR6_2: R6.2 R7.1 U7.16(PC1)

Not connected (* = marked no-connect by the designer): U7 2(PE3)* 8(PC14)* 9(PC15)* 13(PH1)* 15(PC0)* 17(PC2_C)* 22(PA0)* 25(PA3)* 32(PC4)* 36(PB2)* 40(PE10)* 42(PE12)* 45(PE15)* 57(PD10)* 58(PD11)* 67(PA8)* 68(PA9)* 69(PA10)* 77(PA15)* 85(PD4)* 86(PD5)* 87(PD6)*

### Notes on the sheet
- MCU
- Comments
- Decoupling and bulk Filtering
- 1) Instead of using a crystal resonator for
  external clock source, We will use CMOS,
  BYPASS clock oscillator. Safer to get right
  and less hassle/requirements
- 2) Motors PWM Pins were choosen to avoid
  DMA conflicts, motors utilize both Advanced
  timers TIM1 and TIM8 with 4 channels each.
- Dont change the motors pin config
- Analog Filter
- 3) DJI_SBUS -> RC commands from DJI
  controller to FC.
  100kbps
  inverted, RX pin only
  (UART4_RX)
- IMU_INT1 -> GPIO_EXTI2
  IMU2_INT -> GPIO_EXTI4
  BMP388_INT -> GPIO_EXTI1
  if you wish to change, make sure
  GPIO_EXT are diff for each sensor
- MCU_BOOT
- 4) On board Magnetometer and Airspeed
  sensor module will share the same
  I2C1 bus
- Reset
- crystal oscillator
- Status LED's
- mouting holes 3.2mm each, applicable
  for M3 screws. maintin 30.5mm spaces
  in each direction in the layout
- 1
- 2
- 3
- 4
- 5
- 6
- 7
- 8
- 9
- A
- B
- C
- D
- E
- Title:
- File: MCU.kicad_sch
- Sheet: /
- KiCad E.D.A.  kicad (5.1.4)-1
- Size: User
- Date:
- Rev:
- Id: 1/1

### Library data of the parts
C21-C35 = C_Small
  C21 C30: Value: 10nF
  C22: Value: 4.7uF
  C23 C27: Value: 1uF
  C24-C26 C28 C29 C31-C33: Value: 0.1uF
  C34 C35: Value: 2.2uF
FB1 = FerriteBead_Small: Value: 1k@100Mhz
R6-R8 R15-R18 = R_Small
  R6: Value: 4.42k
  R7: Value: 20k
  R8: Value: 0
  R15 R16: Value: 10k
  R17 R18: Value: 330
SW1 SW2 = SW_Push
  SW1: Value: reset
  SW2: Value: MCU_BOOT
Y1 = ASE-xxxMHz: Value: ASE-8.000MHZ-LC-T
#FLG09 = PWR_FLAG: Value: PWR_FLAG
D6 D7 = LED: Value: LED
H1-H4 = MountingHole: Value: MountingHole
U7 = STM32H743VITx: Value: STM32H743VITx

## Sheet connectors.SchDoc
size 431 x 254 mm
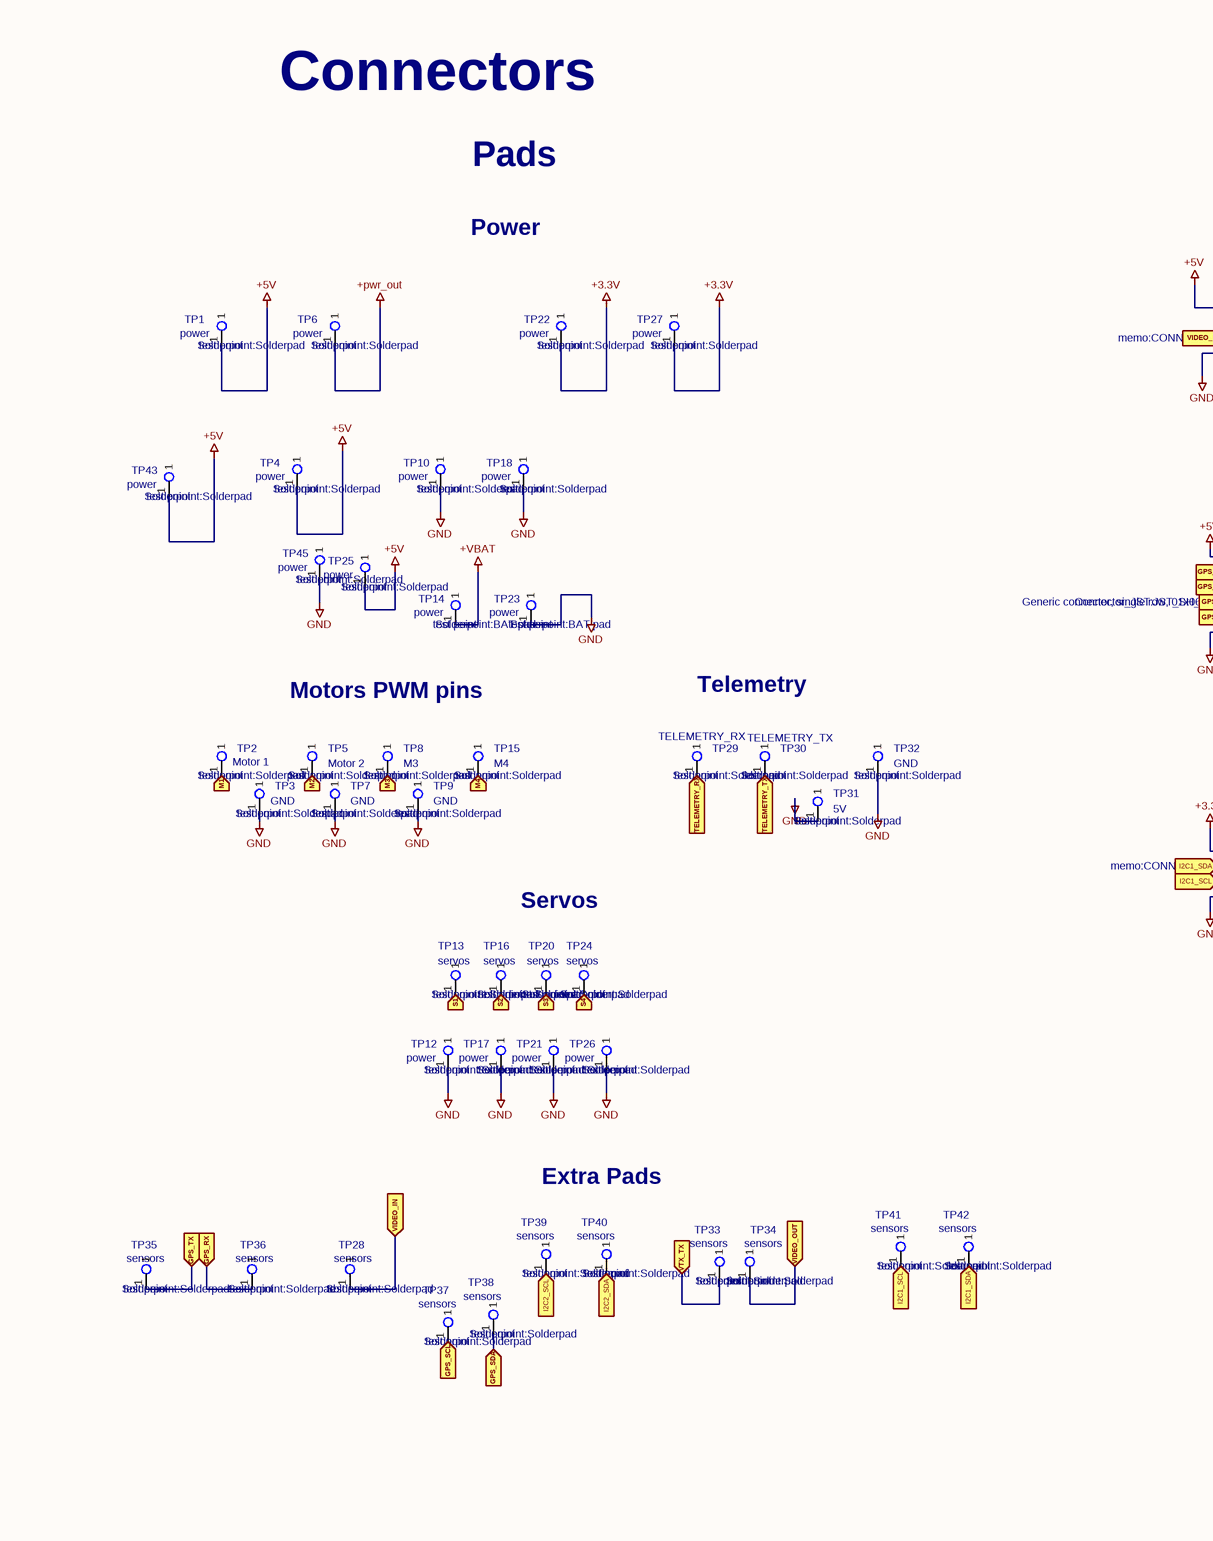
[diagram p7: connectors.SchDoc, left]
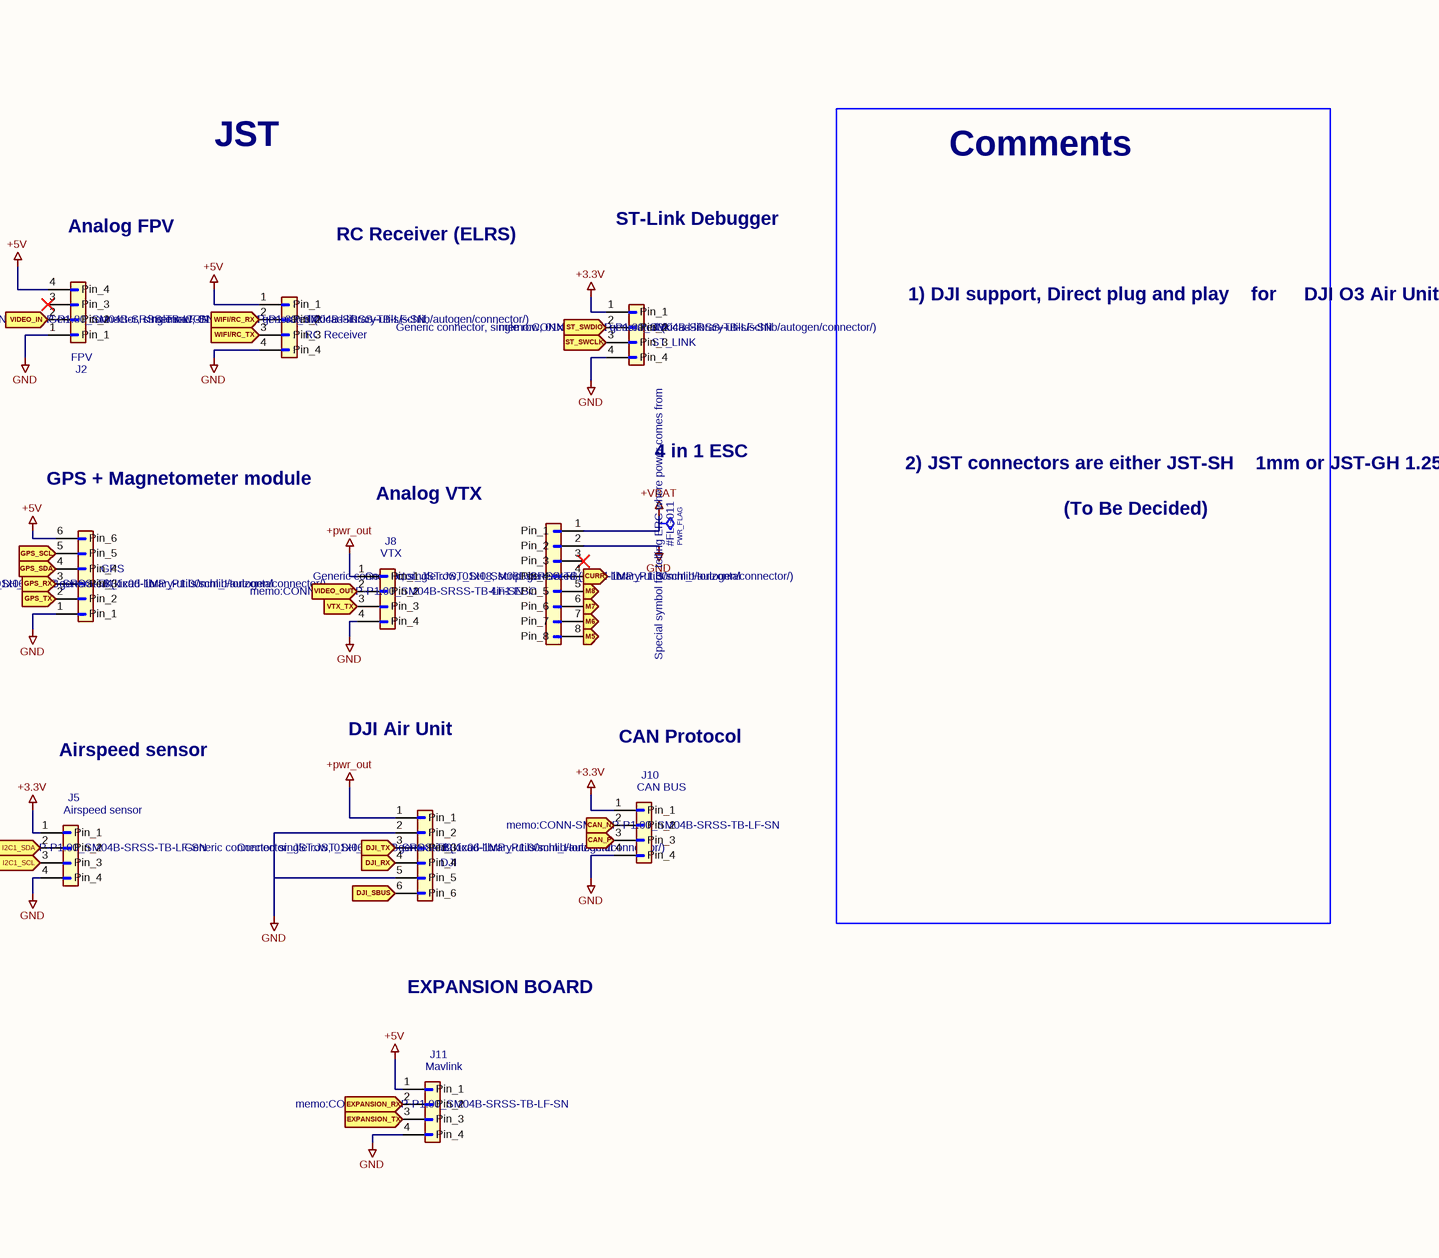
[diagram p8: connectors.SchDoc, right]

### Parts
#FLG011  Description: Special symbol for telling ERC where power comes from  (hidden comment: PWR_FLAG)  (graphical)
J2  Footprint: memo:CONN-SMD_4P-P1.00_SM04B-SRSS-TB-LF-SN  [CONN-SMD_4P-P1.00_SM04B-SRSS-TB-LF-SN]  (hidden comment: FPV)
J3  Description: Generic connector, single row, 01x04, script generated (kicad-library-utils/schlib/autogen/connector/)  Footprint: memo:CONN-SMD_4P-P1.00_SM04B-SRSS-TB-LF-SN  [CONN-SMD_4P-P1.00_SM04B-SRSS-TB-LF-SN]  (hidden comment: ST_LINK)
J4  Description: Generic connector, single row, 01x06, script generated (kicad-library-utils/schlib/autogen/connector/)  Footprint: Connector_JST:JST_SH_SM06B-SRSS-TB_1x06-1MP_P1.00mm_Horizontal  [JST_SH_SM06B-SRSS-TB_1x06-1MP_P1.00mm_Horizontal]  (hidden comment: GPS)
J5  Footprint: memo:CONN-SMD_4P-P1.00_SM04B-SRSS-TB-LF-SN  [CONN-SMD_4P-P1.00_SM04B-SRSS-TB-LF-SN]  (hidden comment: Airspeed sensor)
J6  Description: Generic connector, single row, 01x08, script generated (kicad-library-utils/schlib/autogen/connector/)  Footprint: Connector_JST:JST_SH_SM08B-SRSS-TB_1x08-1MP_P1.00mm_Horizontal  [JST_SH_SM08B-SRSS-TB_1x08-1MP_P1.00mm_Horizontal]  (hidden comment: 4in1 ESC)
J7  Description: Generic connector, single row, 01x04, script generated (kicad-library-utils/schlib/autogen/connector/)  Footprint: memo:CONN-SMD_4P-P1.00_SM04B-SRSS-TB-LF-SN  [CONN-SMD_4P-P1.00_SM04B-SRSS-TB-LF-SN]  (hidden comment: RC Receiver)
J8  Footprint: memo:CONN-SMD_4P-P1.00_SM04B-SRSS-TB-LF-SN  [CONN-SMD_4P-P1.00_SM04B-SRSS-TB-LF-SN]  (hidden comment: VTX)
J9  Description: Generic connector, single row, 01x06, script generated (kicad-library-utils/schlib/autogen/connector/)  Footprint: Connector_JST:JST_SH_SM06B-SRSS-TB_1x06-1MP_P1.00mm_Horizontal  [JST_SH_SM06B-SRSS-TB_1x06-1MP_P1.00mm_Horizontal]  (hidden comment: DJI)
J10  Footprint: memo:CONN-SMD_4P-P1.00_SM04B-SRSS-TB-LF-SN  [CONN-SMD_4P-P1.00_SM04B-SRSS-TB-LF-SN]  (hidden comment: CAN BUS)
J11  Footprint: memo:CONN-SMD_4P-P1.00_SM04B-SRSS-TB-LF-SN  [CONN-SMD_4P-P1.00_SM04B-SRSS-TB-LF-SN]  (hidden comment: Mavlink)
TP1  Description: test point  Footprint: Solderpoint:Solderpad  [Solderpad]  (hidden comment: power)
TP2  Description: test point  Footprint: Solderpoint:Solderpad  [Solderpad]  (hidden comment: Motor 1)
TP3  Description: test point  Footprint: Solderpoint:Solderpad  [Solderpad]  (hidden comment: GND)
TP4  Description: test point  Footprint: Solderpoint:Solderpad  [Solderpad]  (hidden comment: power)
TP5  Description: test point  Footprint: Solderpoint:Solderpad  [Solderpad]  (hidden comment: Motor 2)
TP6  Description: test point  Footprint: Solderpoint:Solderpad  [Solderpad]  (hidden comment: power)
TP7  Description: test point  Footprint: Solderpoint:Solderpad  [Solderpad]  (hidden comment: GND)
TP8  Description: test point  Footprint: Solderpoint:Solderpad  [Solderpad]  (hidden comment: M3)
TP9  Description: test point  Footprint: Solderpoint:Solderpad  [Solderpad]  (hidden comment: GND)
TP10  Description: test point  Footprint: Solderpoint:Solderpad  [Solderpad]  (hidden comment: power)
TP12  Description: test point  Footprint: Solderpoint:Solderpad  [Solderpad]  (hidden comment: power)
TP13  Description: test point  Footprint: Solderpoint:Solderpad  [Solderpad]  (hidden comment: servos)
TP14  Description: test point  Footprint: Solderpoint:BAT pad  [BAT pad]  (hidden comment: power)
TP15  Description: test point  Footprint: Solderpoint:Solderpad  [Solderpad]  (hidden comment: M4)
TP16  Description: test point  Footprint: Solderpoint:Solderpad  [Solderpad]  (hidden comment: servos)
TP17  Description: test point  Footprint: Solderpoint:Solderpad  [Solderpad]  (hidden comment: power)
TP18  Description: test point  Footprint: Solderpoint:Solderpad  [Solderpad]  (hidden comment: power)
TP20  Description: test point  Footprint: Solderpoint:Solderpad  [Solderpad]  (hidden comment: servos)
TP21  Description: test point  Footprint: Solderpoint:Solderpad  [Solderpad]  (hidden comment: power)
TP22  Description: test point  Footprint: Solderpoint:Solderpad  [Solderpad]  (hidden comment: power)
TP23  Description: test point  Footprint: Solderpoint:BAT pad  [BAT pad]  (hidden comment: power)
TP24  Description: test point  Footprint: Solderpoint:Solderpad  [Solderpad]  (hidden comment: servos)
TP25  Description: test point  Footprint: Solderpoint:Solderpad  [Solderpad]  (hidden comment: power)
TP26  Description: test point  Footprint: Solderpoint:Solderpad  [Solderpad]  (hidden comment: power)
TP27  Description: test point  Footprint: Solderpoint:Solderpad  [Solderpad]  (hidden comment: power)
TP28  Description: test point  Footprint: Solderpoint:Solderpad  [Solderpad]  (hidden comment: sensors)
TP29  Description: test point  Footprint: Solderpoint:Solderpad  [Solderpad]  (hidden comment: TELEMETRY_RX)
TP30  Description: test point  Footprint: Solderpoint:Solderpad  [Solderpad]  (hidden comment: TELEMETRY_TX)
TP31  Description: test point  Footprint: Solderpoint:Solderpad  [Solderpad]  (hidden comment: 5V)
TP32  Description: test point  Footprint: Solderpoint:Solderpad  [Solderpad]  (hidden comment: GND)
TP33  Description: test point  Footprint: Solderpoint:Solderpad  [Solderpad]  (hidden comment: sensors)
TP34  Description: test point  Footprint: Solderpoint:Solderpad  [Solderpad]  (hidden comment: sensors)
TP35  Description: test point  Footprint: Solderpoint:Solderpad  [Solderpad]  (hidden comment: sensors)
TP36  Description: test point  Footprint: Solderpoint:Solderpad  [Solderpad]  (hidden comment: sensors)
TP37  Description: test point  Footprint: Solderpoint:Solderpad  [Solderpad]  (hidden comment: sensors)
TP38  Description: test point  Footprint: Solderpoint:Solderpad  [Solderpad]  (hidden comment: sensors)
TP39  Description: test point  Footprint: Solderpoint:Solderpad  [Solderpad]  (hidden comment: sensors)
TP40  Description: test point  Footprint: Solderpoint:Solderpad  [Solderpad]  (hidden comment: sensors)
TP41  Description: test point  Footprint: Solderpoint:Solderpad  [Solderpad]  (hidden comment: sensors)
TP42  Description: test point  Footprint: Solderpoint:Solderpad  [Solderpad]  (hidden comment: sensors)
TP43  Description: test point  Footprint: Solderpoint:Solderpad  [Solderpad]  (hidden comment: power)
TP45  Description: test point  Footprint: Solderpoint:Solderpad  [Solderpad]  (hidden comment: power)

### Ports
CAN_N (in), CAN_P (in), CURR (in), DJI_RX (in), DJI_SBUS (in), DJI_TX (in), EXPANSION_RX (in), EXPANSION_TX (in), GPS_RX (in), GPS_SCL (in), GPS_SDA (in), GPS_TX (in), I2C1_SCL (in), I2C1_SDA (in), I2C2_SCL (in), I2C2_SDA (in), M1 (in), M2 (in), M3 (in), M4 (in), M5 (in), M6 (in), M7 (in), M8 (in), S1 (in), S2 (in), S3 (in), S4 (in), ST_SWCLK (in), ST_SWDIO (in), TELEMETRY_RX (in), TELEMETRY_TX (in), VIDEO_IN (in), VIDEO_OUT (in), VTX_TX (in), WIFI/RC_RX (in), WIFI/RC_TX (in)

### Nets
+3.3V: J3.1(Pin_1) J5.1(Pin_1) J10.1(Pin_1) TP22.1 TP27.1
+5V: J2.4(Pin_4) J4.6(Pin_6) J7.1(Pin_1) J11.1(Pin_1) TP1.1 TP4.1 TP25.1 TP43.1  [project net FB_5V]
+pwr_out: J8.1(Pin_1) J9.1(Pin_1) TP6.1
+VBAT: #FLG011.1 J6.1(Pin_1) TP14.1
GND: J2.1(Pin_1) J3.4(Pin_4) J4.1(Pin_1) J5.4(Pin_4) J6.2(Pin_2) J7.4(Pin_4) J8.4(Pin_4) J9.2(Pin_2) J9.5(Pin_5) J10.4(Pin_4) J11.4(Pin_4) TP3.1 TP7.1 TP9.1 TP10.1 TP12.1 TP17.1 TP18.1 TP21.1 TP23.1 TP26.1 TP31.1 TP32.1 TP45.1
CAN_N: J10.2(Pin_2) ; port CAN_N
CAN_P: J10.3(Pin_3) ; port CAN_P
CURR: J6.4(Pin_4) ; port CURR
DJI_RX: J9.4(Pin_4) ; port DJI_RX
DJI_SBUS: J9.6(Pin_6) ; port DJI_SBUS
DJI_TX: J9.3(Pin_3) ; port DJI_TX
EXPANSION_RX: J11.2(Pin_2) ; port EXPANSION_RX
EXPANSION_TX: J11.3(Pin_3) ; port EXPANSION_TX
GPS_RX: J4.3(Pin_3) TP36.1 ; port GPS_RX
GPS_SCL: J4.5(Pin_5) TP37.1 ; port GPS_SCL
GPS_SDA: J4.4(Pin_4) TP38.1 ; port GPS_SDA
GPS_TX: J4.2(Pin_2) TP35.1 ; port GPS_TX
I2C1_SCL: J5.3(Pin_3) TP41.1 ; port I2C1_SCL
I2C1_SDA: J5.2(Pin_2) TP42.1 ; port I2C1_SDA
I2C2_SCL: TP39.1 ; port I2C2_SCL
I2C2_SDA: TP40.1 ; port I2C2_SDA
M1: TP2.1 ; port M1
M2: TP5.1 ; port M2
M3: TP8.1 ; port M3
M4: TP15.1 ; port M4
M5: J6.8(Pin_8) ; port M5
M6: J6.7(Pin_7) ; port M6
M7: J6.6(Pin_6) ; port M7
M8: J6.5(Pin_5) ; port M8
S1: TP13.1 ; port S1
S2: TP16.1 ; port S2
S3: TP20.1 ; port S3
S4: TP24.1 ; port S4
ST_SWCLK: J3.3(Pin_3) ; port ST_SWCLK
ST_SWDIO: J3.2(Pin_2) ; port ST_SWDIO
TELEMETRY_RX: TP29.1 ; port TELEMETRY_RX
TELEMETRY_TX: TP30.1 ; port TELEMETRY_TX
VIDEO_IN: J2.2(Pin_2) TP28.1 ; port VIDEO_IN
VIDEO_OUT: J8.2(Pin_2) TP34.1 ; port VIDEO_OUT
VTX_TX: J8.3(Pin_3) TP33.1 ; port VTX_TX
WIFI/RC_RX: J7.2(Pin_2) ; port WIFI/RC_RX
WIFI/RC_TX: J7.3(Pin_3) ; port WIFI/RC_TX

Not connected (* = marked no-connect by the designer): J2 3(Pin_3)*; J6 3(Pin_3)*

### Notes on the sheet
- Connectors
- Pads
- JST
- Power
- ST-Link Debugger
- Comments
- (near J2) Analog FPV
- RC Receiver (ELRS)
- 1) DJI support, Direct plug and play
  for
  DJI O3 Air Unit
  DJI FPV Air Unit v1
  DJI FPV Vista / Caddx Vista
  DJI RunCam Link
  DJI Air Unit Lite (Vista variants)
- 4 in 1 ESC
- (near J4) GPS + Magnetometer module
- Analog VTX
- 2) JST connectors are either JST-SH
  1mm or JST-GH 1.25mm industry
  standard
- (To Be Decided)
- Motors PWM pins
- Telemetry
- Airspeed sensor
- DJI Air Unit
- CAN Protocol
- Servos
- EXPANSION BOARD
- Extra Pads
- 1
- 2
- 3
- 4
- 5
- 6
- 7
- 8
- A
- B
- C
- D
- Title:
- File: connectors.kicad_sch
- Sheet: /
- E
- KiCad E.D.A.  kicad (5.1.4)-1
- Size: User
- Date:
- Rev:
- Id: 1/1

### Library data of the parts
J2 J3 J5 J7 J8 J10 J11 = Conn_01x04
  J2: Value: FPV
  J3: Value: ST_LINK
  J5: Value: Airspeed sensor
  J7: Value: RC Receiver
  J8: Value: VTX
  J10: Value: CAN BUS
  J11: Value: Mavlink
J4 J9 = Conn_01x06
  J4: Value: GPS
  J9: Value: DJI
J6 = Conn_01x08: Value: 4in1 ESC
TP1-TP10 TP12-TP18 TP20-TP43 TP45 = TestPoint
  TP1 TP4 TP6 TP10 TP12 TP14 TP17 TP18 TP21-TP23 TP25-TP27 TP43 TP45: Value: power
  TP2: Value: Motor 1
  TP3 TP7 TP9 TP32: Value: GND
  TP5: Value: Motor 2
  TP8: Value: M3
  TP13 TP16 TP20 TP24: Value: servos
  TP15: Value: M4
  TP28 TP33-TP42: Value: sensors
  TP29: Value: TELEMETRY_RX
  TP30: Value: TELEMETRY_TX
  TP31: Value: 5V
#FLG011 = PWR_FLAG: Value: PWR_FLAG

## Sheet Sensors.SchDoc
size 635 x 279 mm
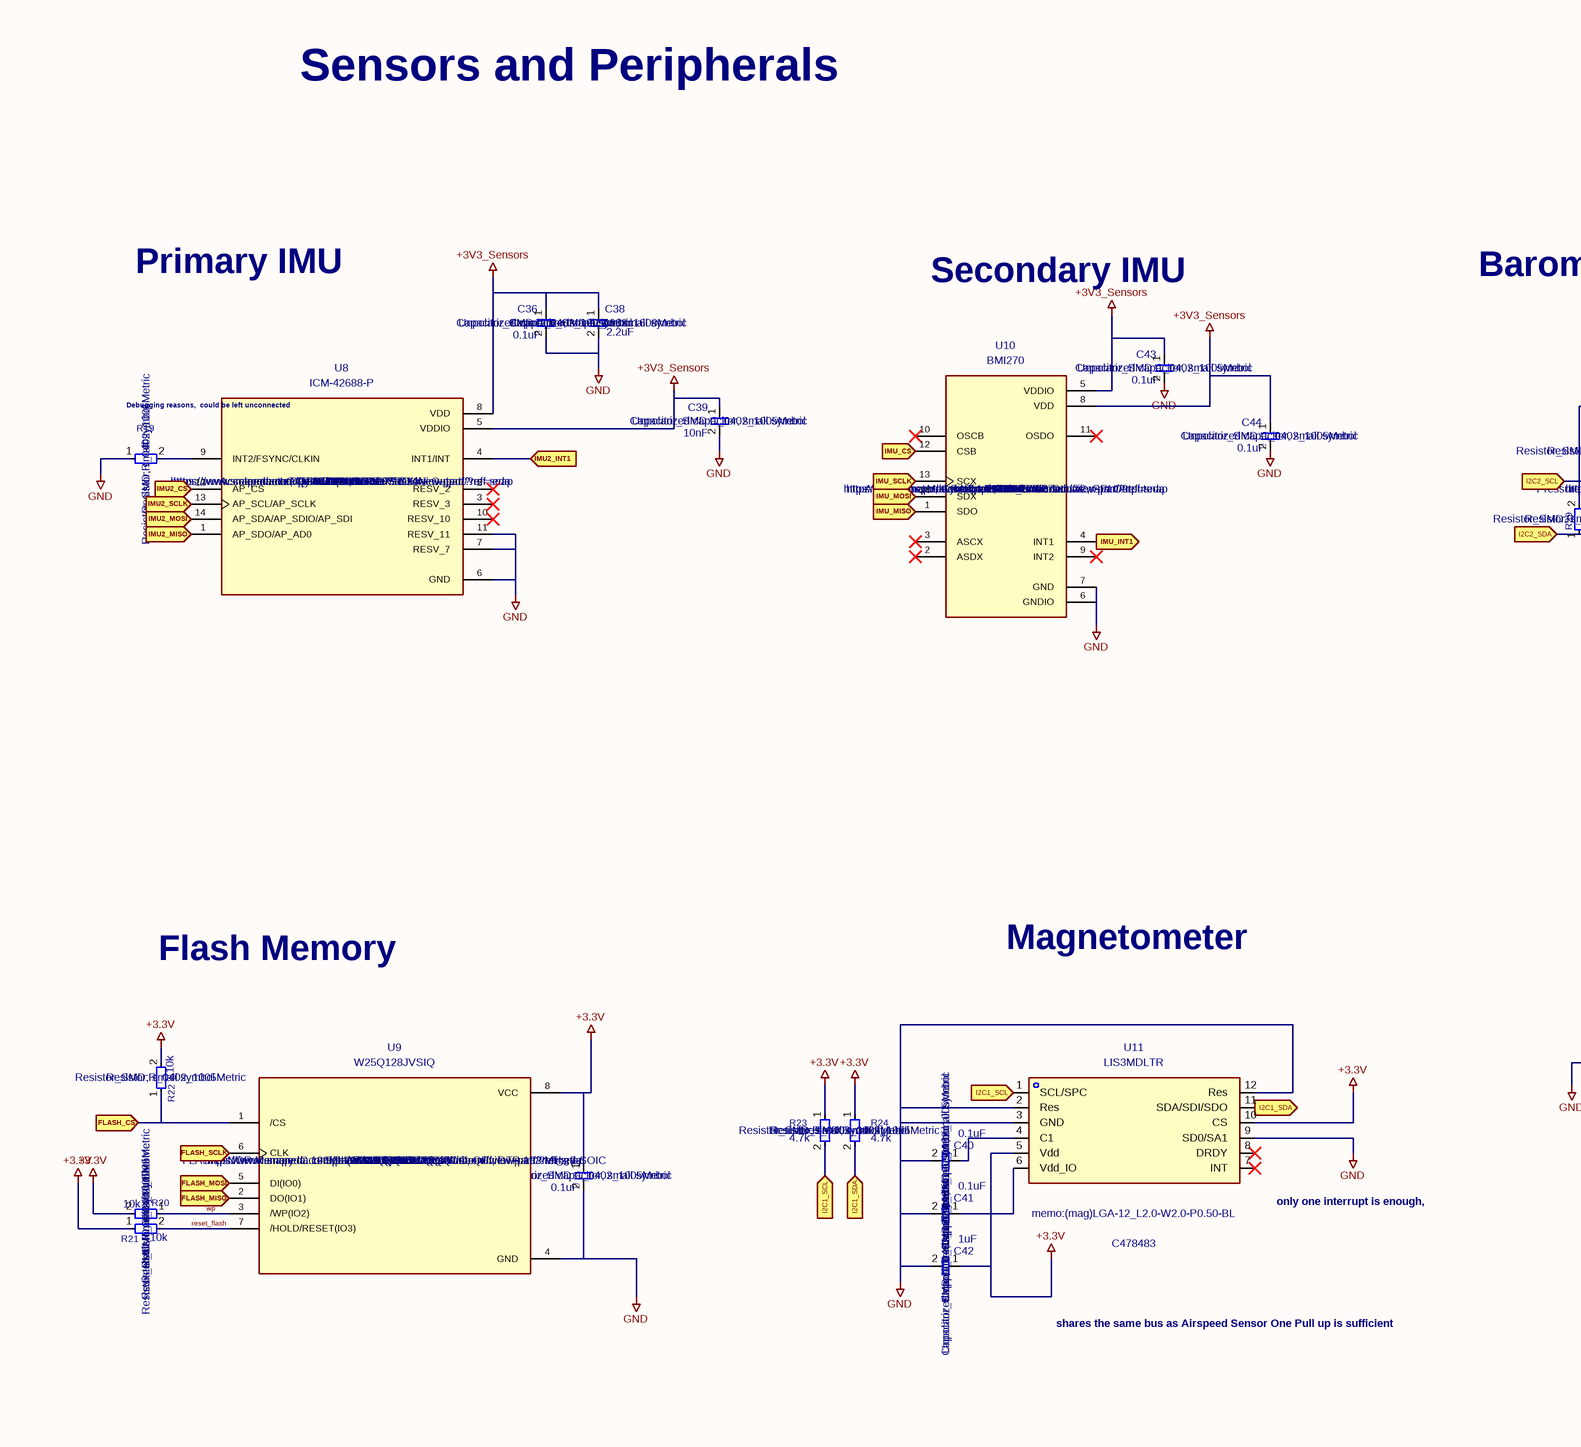
[diagram p9: Sensors.SchDoc, left]
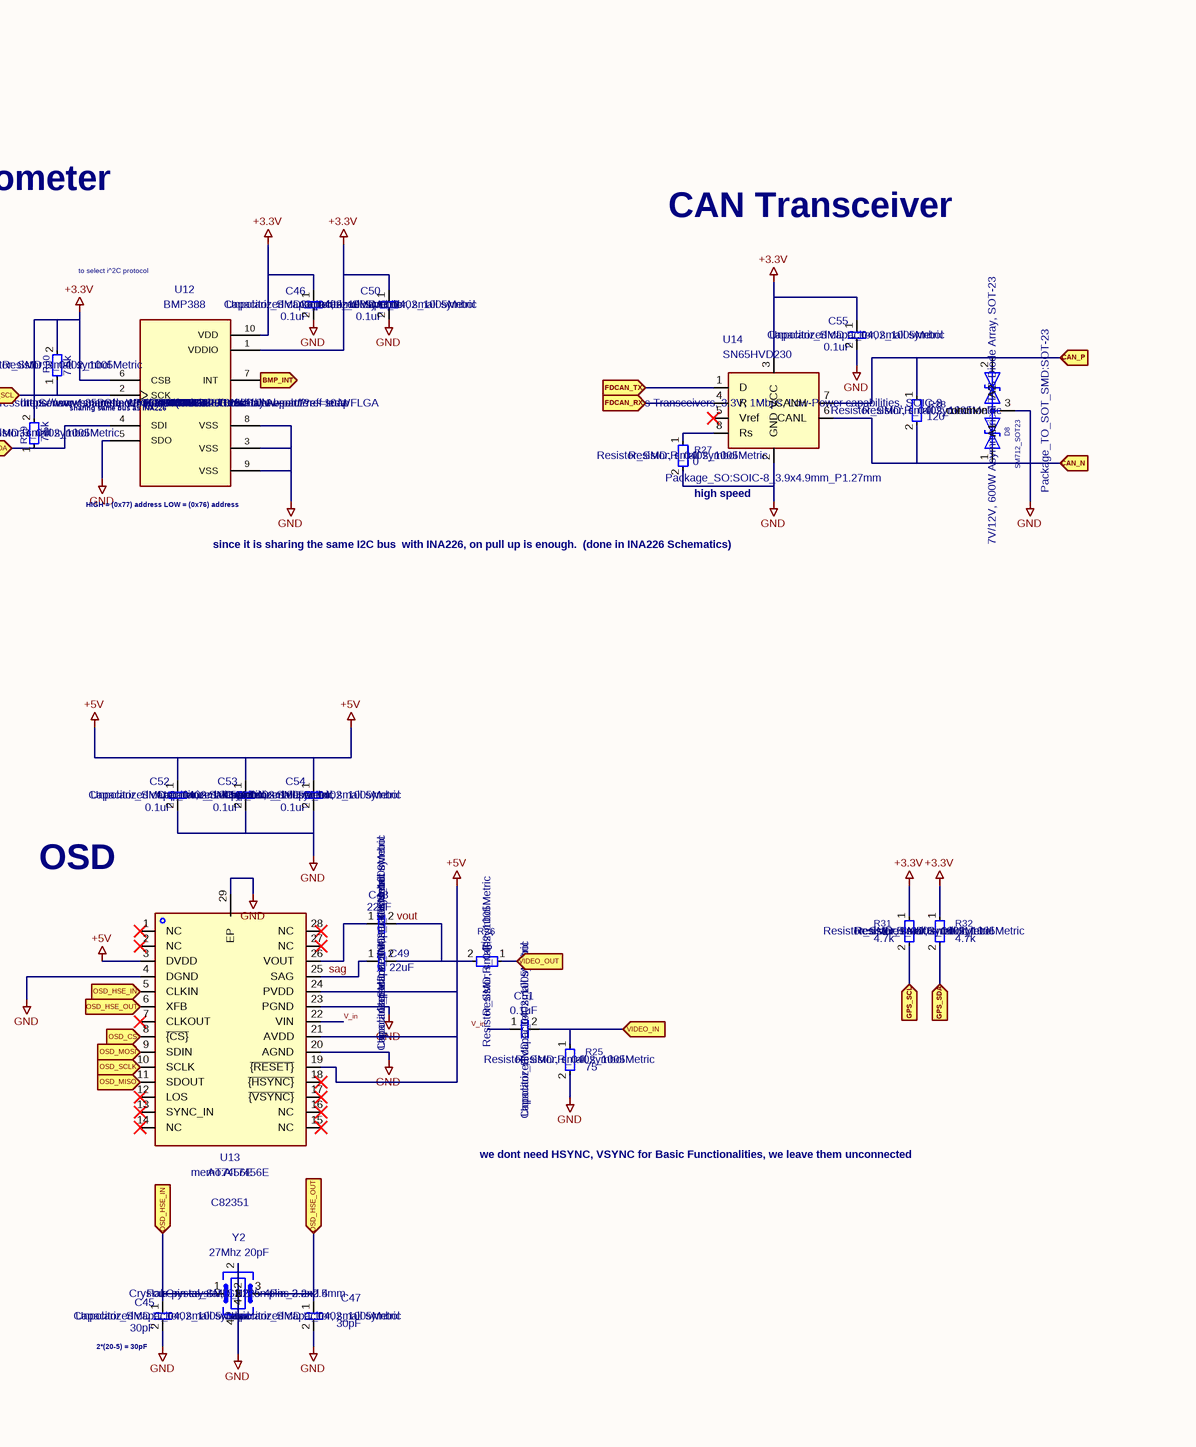
[diagram p10: Sensors.SchDoc, middle]
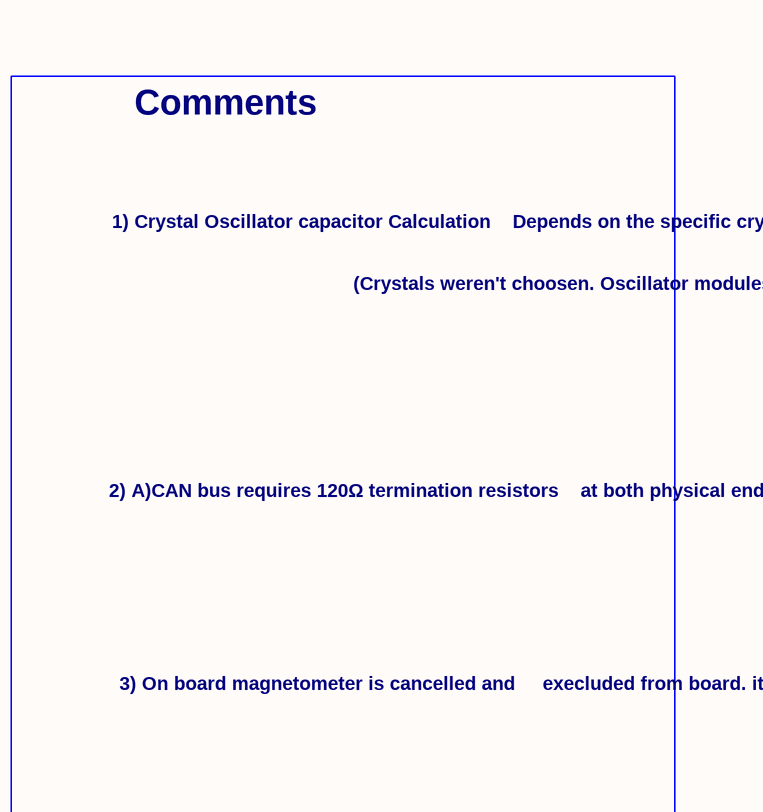
[diagram p11: Sensors.SchDoc, right]

### Parts
C36  Description: Unpolarized capacitor, small symbol  Footprint: Capacitor_SMD:C_0402_1005Metric  [C_0402_1005Metric]  (hidden comment: 0.1uF)
C37  Description: Unpolarized capacitor, small symbol  Footprint: Capacitor_SMD:C_0402_1005Metric  [C_0402_1005Metric]  (hidden comment: 0.1uF)
C38  Description: Unpolarized capacitor, small symbol  Footprint: Capacitor_SMD:C_0603_1608Metric  [C_0603_1608Metric]  (hidden comment: 2.2uF)
C39  Description: Unpolarized capacitor, small symbol  Footprint: Capacitor_SMD:C_0402_1005Metric  [C_0402_1005Metric]  (hidden comment: 10nF)
C40  Description: Unpolarized capacitor, small symbol  Footprint: Capacitor_SMD:C_0402_1005Metric  [C_0402_1005Metric]  (hidden comment: 0.1uF)
C41  Description: Unpolarized capacitor, small symbol  Footprint: Capacitor_SMD:C_0402_1005Metric  [C_0402_1005Metric]  (hidden comment: 0.1uF)
C42  Description: Unpolarized capacitor, small symbol  Footprint: Capacitor_SMD:C_0402_1005Metric  [C_0402_1005Metric]  (hidden comment: 1uF)
C43  Description: Unpolarized capacitor, small symbol  Footprint: Capacitor_SMD:C_0402_1005Metric  [C_0402_1005Metric]  (hidden comment: 0.1uF)
C44  Description: Unpolarized capacitor, small symbol  Footprint: Capacitor_SMD:C_0402_1005Metric  [C_0402_1005Metric]  (hidden comment: 0.1uF)
C45  Description: Unpolarized capacitor, small symbol  Footprint: Capacitor_SMD:C_0402_1005Metric  [C_0402_1005Metric]  (hidden comment: 30pF)
C46  Description: Unpolarized capacitor, small symbol  Footprint: Capacitor_SMD:C_0402_1005Metric  [C_0402_1005Metric]  (hidden comment: 0.1uF)
C47  Description: Unpolarized capacitor, small symbol  Footprint: Capacitor_SMD:C_0402_1005Metric  [C_0402_1005Metric]  (hidden comment: 30pF)
C48  Description: Unpolarized capacitor, small symbol  Footprint: Capacitor_SMD:C_0603_1608Metric  [C_0603_1608Metric]  (hidden comment: 22uF)
C49  Description: Unpolarized capacitor, small symbol  Footprint: Capacitor_SMD:C_0603_1608Metric  [C_0603_1608Metric]  (hidden comment: 22uF)
C50  Description: Unpolarized capacitor, small symbol  Footprint: Capacitor_SMD:C_0402_1005Metric  [C_0402_1005Metric]  (hidden comment: 0.1uF)
C51  Description: Unpolarized capacitor, small symbol  Footprint: Capacitor_SMD:C_0402_1005Metric  [C_0402_1005Metric]  (hidden comment: 0.1uF)
C52  Description: Unpolarized capacitor, small symbol  Footprint: Capacitor_SMD:C_0402_1005Metric  [C_0402_1005Metric]  (hidden comment: 0.1uF)
C53  Description: Unpolarized capacitor, small symbol  Footprint: Capacitor_SMD:C_0402_1005Metric  [C_0402_1005Metric]  (hidden comment: 0.1uF)
C54  Description: Unpolarized capacitor, small symbol  Footprint: Capacitor_SMD:C_0402_1005Metric  [C_0402_1005Metric]  (hidden comment: 0.1uF)
C55  Description: Unpolarized capacitor, small symbol  Footprint: Capacitor_SMD:C_0402_1005Metric  [C_0402_1005Metric]  (hidden comment: 0.1uF)
D8  Description: 7V/12V, 600W Asymmetrical TVS Diode Array, SOT-23  Footprint: Package_TO_SOT_SMD:SOT-23  [SOT-23]  (hidden comment: SM712_SOT23)
R19  Description: Resistor, small symbol  Footprint: Resistor_SMD:R_0402_1005Metric  [R_0402_1005Metric]  (hidden comment: 0)
R20  Description: Resistor, small symbol  Footprint: Resistor_SMD:R_0402_1005Metric  [R_0402_1005Metric]  (hidden comment: 10k)
R21  Description: Resistor, small symbol  Footprint: Resistor_SMD:R_0402_1005Metric  [R_0402_1005Metric]  (hidden comment: 10k)
R22  Description: Resistor, small symbol  Footprint: Resistor_SMD:R_0402_1005Metric  [R_0402_1005Metric]  (hidden comment: 10k)
R23  Description: Resistor, small symbol  Footprint: Resistor_SMD:R_0402_1005Metric  [R_0402_1005Metric]  (hidden comment: 4.7k)
R24  Description: Resistor, small symbol  Footprint: Resistor_SMD:R_0402_1005Metric  [R_0402_1005Metric]  (hidden comment: 4.7k)
R25  Description: Resistor, small symbol  Footprint: Resistor_SMD:R_0402_1005Metric  [R_0402_1005Metric]  (hidden comment: 75)
R26  Description: Resistor, small symbol  Footprint: Resistor_SMD:R_0402_1005Metric  [R_0402_1005Metric]  (hidden comment: 75)
R27  Description: Resistor, small symbol  Footprint: Resistor_SMD:R_0402_1005Metric  [R_0402_1005Metric]  (hidden comment: 0)
R28  Description: Resistor, small symbol  Footprint: Resistor_SMD:R_0402_1005Metric  [R_0402_1005Metric]  (hidden comment: 120)
R29  Description: Resistor, small symbol  Footprint: Resistor_SMD:R_0402_1005Metric  [R_0402_1005Metric]  (hidden comment: 7.5k)
R30  Description: Resistor, small symbol  Footprint: Resistor_SMD:R_0402_1005Metric  [R_0402_1005Metric]  (hidden comment: 7.5k)
R31  Description: Resistor, small symbol  Footprint: Resistor_SMD:R_0402_1005Metric  [R_0402_1005Metric]  (hidden comment: 4.7k)
R32  Description: Resistor, small symbol  Footprint: Resistor_SMD:R_0402_1005Metric  [R_0402_1005Metric]  (hidden comment: 4.7k)
U8  MF: TDK InvenSense  MAXIMUM_PACKAGE_HEIGHT: 0.97mm  Package: LGA-14 TDK InvenSense  Price: None  STANDARD: IPC-7351B  PARTREV: 1.2  Description_1: Accelerometer, Gyroscope, 6 Axis Sensor - Output  Availability: In Stock  Footprint: memo:PQFN50P300X250X97-14N  [PQFN50P300X250X97-14N]  (hidden comment: ICM-42688-P)
U9  MF: Winbond Electronics  MAXIMUM_PACKAGE_HEIGHT: 2.16 mm  Package: SOIC-8 Winbond Electronics  Price: None  STANDARD: IPC-7351B  PARTREV: I  Description_1: FLASH - NOR Memory IC 128Mb (16M x 8) SPI - Quad I/O, QPI, DTR 133 MHz 8-SOIC  Availability: In Stock  Footprint: memo:W25Q128JVSIQ  [W25Q128JVSIQ]  (hidden comment: W25Q128JVSIQ)
U10  PATREV: 1.0  MF: Bosch Sensortec  MAXIMUM_PACKAGE_HEIGHT: 0.87mm  Package: LGA-14 Bosch Sensortec  Price: None  STANDARD: Manufacturer Recommendations  Description_1: Accelerometer, Gyroscope, 6 Axis Sensor I2C, SPI Output  Availability: In Stock  Footprint: memo:XDCR_BMI270  [XDCR_BMI270]  (hidden comment: BMI270)
U11  LCSC Part: C478483  Footprint: memo:(mag)LGA-12_L2.0-W2.0-P0.50-BL  [(mag)LGA-12_L2.0-W2.0-P0.50-BL]  (hidden comment: LIS3MDLTR)
U12  MF: Bosch Sensortec  Description_1: Pressure Sensor 4.35PSI ~ 18.13PSI (30kPa ~ 125kPa) Absolute - - 10-WFLGA  Package: WFLGA-10 Bosch Tools  Price: None  STANDARD: IPC 7351B  PARTREV: 1.1  Availability: In Stock  MANUFACTURER: BOSCH  Footprint: memo:PQFN50P200X200X80-10N  [PQFN50P200X200X80-10N]  (hidden comment: BMP388)
U13  LCSC Part: C82351  Footprint: memo:AT7456E  [AT7456E]  (hidden comment: AT7456E)
U14  Description: CAN Bus Transceivers, 3.3V, 1Mbps, Low-Power capabilities, SOIC-8  Footprint: Package_SO:SOIC-8_3.9x4.9mm_P1.27mm  [SOIC-8_3.9x4.9mm_P1.27mm]  (hidden comment: SN65HVD230)
Y2  Description: Four pin crystal, GND on pins 2 and 4  Footprint: Crystal:Crystal_SMD_3225-4Pin_3.2x2.5mm  [Crystal_SMD_3225-4Pin_3.2x2.5mm]  (hidden comment: 27Mhz 20pF)

### Ports
BMP_INT (in), CAN_N (in), CAN_P (in), FDCAN_RX (in), FDCAN_TX (in), FLASH_CS (in), FLASH_MISO (in), FLASH_MOSI (in), FLASH_SCLK (in), GPS_SCL (in), GPS_SDA (in), I2C1_SCL (in), I2C1_SDA (in), I2C2_SCL (in), I2C2_SDA (in), IMU2_CS (in), IMU2_INT1 (in), IMU2_MISO (in), IMU2_MOSI (in), IMU2_SCLK (in), IMU_CS (in), IMU_INT1 (in), IMU_MISO (in), IMU_MOSI (in), IMU_SCLK (in), OSD_CS (in), OSD_HSE_IN (in), OSD_HSE_OUT (in), OSD_MISO (in), OSD_MOSI (in), OSD_SCLK (in), VIDEO_IN (in), VIDEO_OUT (in)

### Nets
+3.3V: C37.1 C41.1 C42.1 C46.1 C50.1 C55.1 R20.2 R21.1 R22.2 R23.1 R24.1 R29.2 R30.2 R31.1 R32.1 U9.8(VCC) U11.5(Vdd) U11.6(Vdd_IO) U11.10(CS) U12.1(VDDIO) U12.6(CSB) U12.10(VDD) U14.3(VCC)
+3V3_Sensors: C36.1 C38.1 C39.1 C43.1 C44.1 U8.5(VDDIO) U8.8(VDD) U10.5(VDDIO) U10.8(VDD)
+5V: C52.1 C53.1 C54.1 U13.3(DVDD) U13.19(~{{RESET}}) U13.21(AVDD) U13.24(PVDD)  [project net FB_5V]
GND: C36.2 C37.2 C38.2 C39.2 C40.2 C41.2 C42.2 C43.2 C44.2 C45.2 C46.2 C47.2 C50.2 C52.2 C53.2 C54.2 C55.2 D8.3(common) R19.1 R25.2 R27.2 U8.6(GND) U8.7(RESV_7) U8.11(RESV_11) U9.4(GND) U10.6(GNDIO) U10.7(GND) U11.2(Res) U11.3(GND) U11.9(SD0/SA1) U11.12(Res) U12.3(VSS) U12.5(SDO) U12.8(VSS) U12.9(VSS) U13.4(DGND) U13.20(AGND) U13.23(PGND) U13.29(EP) U14.2(GND) Y2.2 Y2.4
BMP_INT: U12.7(INT) ; port BMP_INT
CAN_N: D8.1(A1) R28.2 U14.6(CANL) ; port CAN_N
CAN_P: D8.2(A2) R28.1 U14.7(CANH) ; port CAN_P
FDCAN_RX: U14.4(R) ; port FDCAN_RX
FDCAN_TX: U14.1(D) ; port FDCAN_TX
FLASH_CS: R22.1 U9.1(/CS) ; port FLASH_CS
FLASH_MISO: U9.2(DO(IO1)) ; port FLASH_MISO
FLASH_MOSI: U9.5(DI(IO0)) ; port FLASH_MOSI
FLASH_SCLK: U9.6(CLK) ; port FLASH_SCLK
GPS_SCL: R31.2 ; port GPS_SCL
GPS_SDA: R32.2 ; port GPS_SDA
I2C1_SCL: R23.2 U11.1(SCL/SPC) ; port I2C1_SCL
I2C1_SDA: R24.2 U11.11(SDA/SDI/SDO) ; port I2C1_SDA
I2C2_SCL: R30.1 U12.2(SCK) ; port I2C2_SCL
I2C2_SDA: R29.1 U12.4(SDI) ; port I2C2_SDA
IMU2_CS: U8.12(AP_CS) ; port IMU2_CS
IMU2_INT1: U8.4(INT1/INT) ; port IMU2_INT1
IMU2_MISO: U8.1(AP_SDO/AP_AD0) ; port IMU2_MISO
IMU2_MOSI: U8.14(AP_SDA/AP_SDIO/AP_SDI) ; port IMU2_MOSI
IMU2_SCLK: U8.13(AP_SCL/AP_SCLK) ; port IMU2_SCLK
IMU_CS: U10.12(CSB) ; port IMU_CS
IMU_INT1: U10.4(INT1) ; port IMU_INT1
IMU_MISO: U10.1(SDO) ; port IMU_MISO
IMU_MOSI: U10.14(SDX) ; port IMU_MOSI
IMU_SCLK: U10.13(SCX) ; port IMU_SCLK
OSD_CS: U13.8(~{{CS}}) ; port OSD_CS
OSD_HSE_IN: C45.1 U13.5(CLKIN) Y2.1 ; port OSD_HSE_IN
OSD_HSE_OUT: C47.1 U13.6(XFB) Y2.3 ; port OSD_HSE_OUT
OSD_MISO: U13.11(SDOUT) ; port OSD_MISO
OSD_MOSI: U13.9(SDIN) ; port OSD_MOSI
OSD_SCLK: U13.10(SCLK) ; port OSD_SCLK
reset_flash: R21.2 U9.7(/HOLD/RESET(IO3))
sag: C49.1 U13.25(SAG)
V_in: C51.1 U13.22(VIN)
VIDEO_IN: C51.2 R25.1 ; port VIDEO_IN
VIDEO_OUT: R26.1 ; port VIDEO_OUT
vout: C48.2 C49.2 R26.2
wp: R20.1 U9.3(/WP(IO2))
NetC40_1: C40.1 U11.4(C1)
NetC48_1: C48.1 U13.26(VOUT)
NetR19_2: R19.2 U8.9(INT2/FSYNC/CLKIN)
NetR27_1: R27.1 U14.8(Rs)

Not connected (* = marked no-connect by the designer): U8 2(RESV_2)* 3(RESV_3)* 10(RESV_10)*; U10 2(ASDX)* 3(ASCX)* 9(INT2)* 10(OSCB)* 11(OSDO)*; U11 7(INT)* 8(DRDY)*; U13 1(NC)* 2(NC)* 7(CLKOUT)* 12(LOS)* 13(SYNC_IN)* 14(NC)* 15(NC)* 16(NC)* 17(~{{VSYNC}})* 18(~{{HSYNC}})* 27(NC)* 28(NC)*; U14 5(Vref)*

### Notes on the sheet
- Sensors and Peripherals
- Comments
- Primary IMU
- Secondary IMU
- Barometer
- 1) Crystal Oscillator capacitor Calculation
  Depends on the specific crystal capacitance
  and stray capacitance. Take stray capacitance
  to be 3 - 5 pF.
- (Crystals weren't choosen. Oscillator modules
  for reliable clock generation)
- to select i^2C protocol
- CAN Transceiver
- (near U8) Debugging reasons,
  could be left unconnected
- (near U12) sharing same bus as INA226
- 2) A)CAN bus requires 120Ω termination resistors
  at both physical ends of the bus only.
  If the flight controller is positioned in
  the middle of the CAN chain, no termination
  should be installed. Populate R30 only
  if the flight controller is at one end of the bus.
  B) 0Ω Resistor on RS for slope control,
  now its configured for High speed. If
  the wires are long then 10kΩ - 100kΩ
  should be used
- (near U12) HIGH = (0x77) address
  LOW = (0x76) address
- high speed
- since it is sharing the same I2C bus
  with INA226, on pull up is enough.
  (done in INA226 Schematics)
- 3) On board magnetometer is cancelled and
  execluded from board. it is much more stable
  as an external module paired with GPS
  or individually.
- Flash Memory
- Magnetometer
- OSD
- (near U11) only one interrupt is enough,
- we dont need HSYNC, VSYNC for Basic
  Functionalities, we leave them unconnected
- shares the same bus as Airspeed Sensor
  One Pull up is sufficient
- (near C45) 2*(20-5) = 30pF
- 1
- 2
- 3
- 4
- 5
- 6
- 7
- 8
- 9
- 10
- 11
- 12
- A
- B
- C
- D
- E
- Title:
- File: Sensors.kicad_sch
- Sheet: /
- KiCad E.D.A.  kicad (5.1.4)-1
- Size: User
- Date:
- Rev:
- Id: 1/1

### Library data of the parts
C36-C55 = C_Small
  C36 C37 C40 C41 C43 C44 C46 C50-C55: Value: 0.1uF
  C38: Value: 2.2uF
  C39: Value: 10nF
  C42: Value: 1uF
  C45 C47: Value: 30pF
  C48 C49: Value: 22uF
R19-R32 = R_Small
  R19 R27: Value: 0
  R20-R22: Value: 10k
  R23 R24 R31 R32: Value: 4.7k
  R25 R26: Value: 75
  R28: Value: 120
  R29 R30: Value: 7.5k
Y2 = Crystal_GND24: Value: 27Mhz 20pF
D8 = SM712_SOT23: Value: SM712_SOT23
U8 = ICM-42688-P: Check_prices: https://www.snapeda.com/parts/ICM-42688-P/TDK/view-part/?ref=eda; SnapEDA_Link: https://www.snapeda.com/parts/ICM-42688-P/TDK/view-part/?ref=snap; MP: ICM-42688-P; MANUFACTURER: TDK InvenSense; Value: ICM-42688-P
U9 = W25Q128JVSIQ: Check_prices: https://www.snapeda.com/parts/W25Q128JVSIQ/Winbond/view-part/?ref=eda; SnapEDA_Link: https://www.snapeda.com/parts/W25Q128JVSIQ/Winbond/view-part/?ref=snap; MP: W25Q128JVSIQ; MANUFACTURER: Winbond Electronics; Value: W25Q128JVSIQ
U10 = BMI270: Check_prices: https://www.snapeda.com/parts/BMI270/Bosch/view-part/?ref=eda; SnapEDA_Link: https://www.snapeda.com/parts/BMI270/Bosch/view-part/?ref=snap; MP: BMI270; MANUFACTURER: Bosch Sensortec; Value: BMI270
U11 = LIS3MDLTR: Value: LIS3MDLTR
U12 = BMP388: Check_prices: https://www.snapeda.com/parts/BMP388/Bosch/view-part/?ref=eda; SnapEDA_Link: https://www.snapeda.com/parts/BMP388/Bosch/view-part/?ref=snap; MP: BMP388; Value: BMP388
U13 = AT7456E: Value: AT7456E
U14 = SN65HVD230: Value: SN65HVD230